# EAGLE design openevsetester (EAGLE 9.6.2)

## Sheet 1 of 7
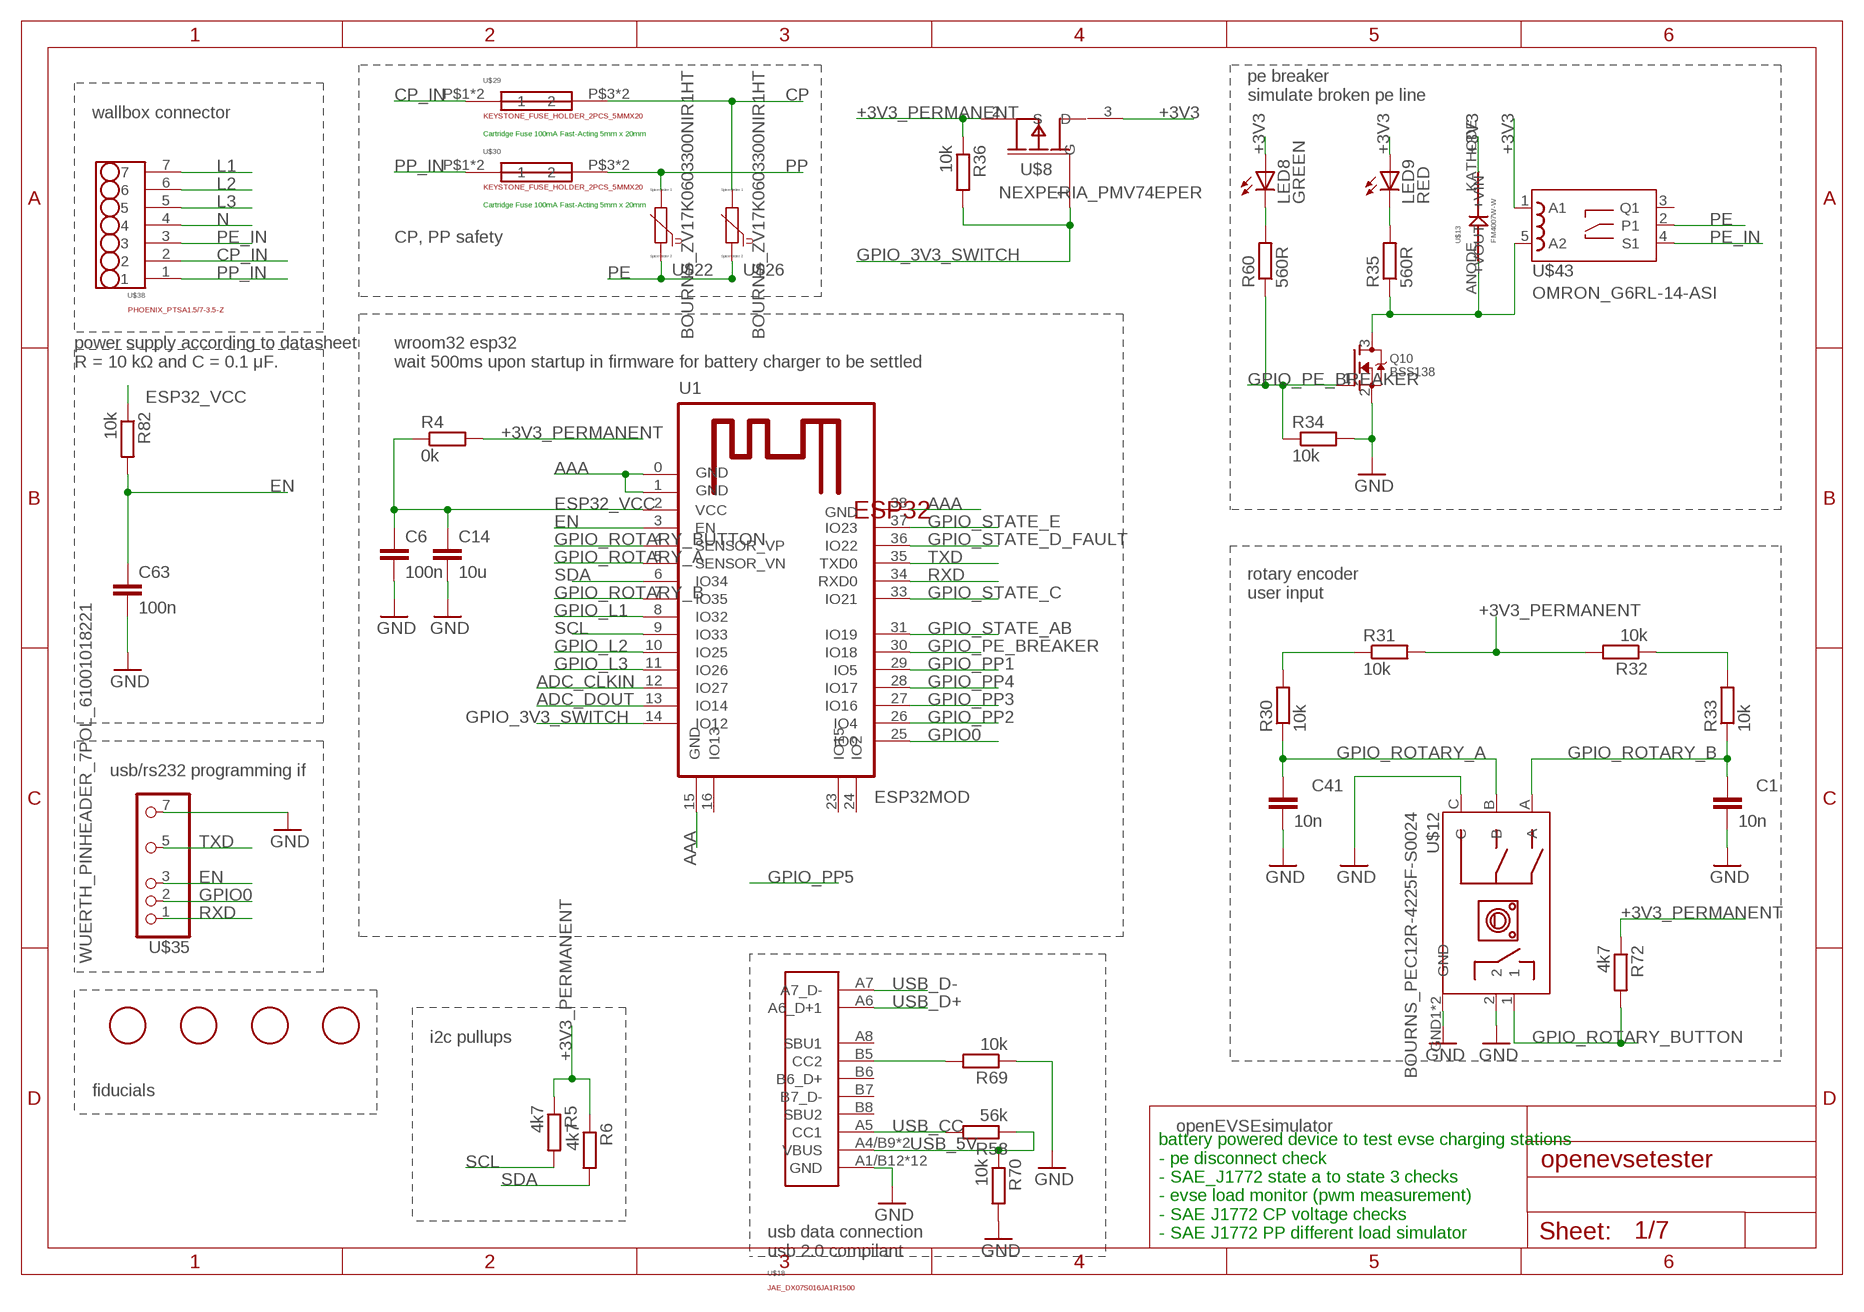
[diagram p0: schematic, sheet 1]

### Parts
C1  10n  C-EUC0402  [C0402]
C6  100n  C-EUC0402  [C0402]
C14  10u  C-EUC0805  [C0805]
C41  10n  C-EUC0402  [C0402]
C63  100n  C-EUC0402  [C0402]
LED8  GREEN  LEDSML0603  [SML0603]
LED9  RED  LEDSML0603  [SML0603]
Q10  BSS138  MOSFET-NREFLOW  [SOT23]
R4  0k  R-EU_R0402  [R0402]
R5  4k7  R-EU_R0402  [R0402]
R6  4k7  R-EU_R0402  [R0402]
R30  10k  R-EU_R0402  [R0402]
R31  10k  R-EU_R0402  [R0402]
R32  10k  R-EU_R0402  [R0402]
R33  10k  R-EU_R0402  [R0402]
R34  10k  R-EU_R0402  [R0402]
R35  560R  R-EU_R0402  [R0402]
R36  10k  R-EU_R0402  [R0402]
R58  56k  R-EU_R0402  [R0402]
R60  560R  R-EU_R0402  [R0402]
R69  10k  R-EU_R0402  [R0402]
R70  10k  R-EU_R0402  [R0402]
R72  4k7  R-EU_R0402  [R0402]
R82  10k  R-EU_R0402  [R0402]
U1  ESP32MOD  [ESP32MOD]
U$8  NEXPERIA_PMV74EPER  [SOT23]
U$12  BOURNS_PEC12R-4225F-S0024  [BOURNS_PEC12RXXX]
U$13  FM4007W-W  [SMX]
U$18  JAE_DX07S016JA1R1500  [JAE_DX07S016JA1R1500]
U$19  FIDUCIAL  [FIDUCIAL_1MM]
U$21  FIDUCIAL  [FIDUCIAL_1MM]
U$22  BOURNS_ZV17K0603300NIR1HT  [0603]
U$23  FIDUCIAL  [FIDUCIAL_1MM]
U$24  FIDUCIAL  [FIDUCIAL_1MM]
U$26  BOURNS_ZV17K0603300NIR1HT  [0603]
U$29  KEYSTONE_FUSE_HOLDER_2PCS_5MMX20  [KEYSTONE_PC_5MM_FUSE_CLIP]
U$30  KEYSTONE_FUSE_HOLDER_2PCS_5MMX20  [KEYSTONE_PC_5MM_FUSE_CLIP]
U$35  WUERTH_PINHEADER_7POL_61001018221  [PINHEADER_SMD_7POL_ESP32_PRG]
U$38  PHOENIX_PTSA1.5/7-3.5-Z  [PHOENIX_PTSA_7POL_3.5MM]
U$43  OMRON_G6RL-14-ASI  [OMRON_G6RL-14-ASI]

### Nets
+3V3: LED8.A LED9.A U$8.3(D) U$13.KATHODE(+VOUT) U$43.1(A1) ; also sheet 5,7
+3V3_PERMANENT: R4.2 R5.1 R6.1 R31.2 R32.2 R36.1 R72.1 U$8.2(S) ; also sheet 4,7
AAA: C1.2 C6.2 C14.2 C41.2 C63.2 Q10.2(S) R34.2 R69.1 R70.2 U1.0(GND) U1.1(GND) U1.15(GND) U1.38(GND) U$12.2 U$12.C U$12.GND1(GND) U$12.GND2(GND) U$18.A1/B12(GND) U$18.A12/B1(GND) U$18.G1(GND) U$18.G2(GND) U$18.G3(GND) U$18.G4(GND) U$18.G5(GND) U$18.G6(GND) U$18.G7(GND) U$18.G8(GND) U$18.P1(GND) U$18.P2(GND) U$35.7 ; supply symbol labelled GND ; also sheet 2,3,4,5,6,7
ADC_CLKIN: U1.12(IO27) ; also sheet 5
ADC_DOUT: U1.13(IO14) ; also sheet 5
CP: U$26.1 U$29.P$3 U$29.PAD2 ; also sheet 3,5
CP_IN: U$29.P$1 U$29.PAD1 U$38.2
EN: C63.1 R82.2 U1.3(EN) U$35.3
ESP32_VCC: C6.1 C14.1 R4.1 R82.1 U1.2(VCC)
GPIO0: U1.25(IO0) U$35.2
GPIO_3V3_SWITCH: R36.2 U1.14(IO12) U$8.1(G)
GPIO_L1: U1.8(IO32) ; also sheet 6
GPIO_L2: U1.10(IO25) ; also sheet 6
GPIO_L3: U1.11(IO26) ; also sheet 6
GPIO_PE_BREAKER: Q10.1(G) R34.1 R60.1 U1.30(IO18)
GPIO_PP1: U1.29(IO5) ; also sheet 2
GPIO_PP2: U1.26(IO4) ; also sheet 2
GPIO_PP3: U1.27(IO16) ; also sheet 2
GPIO_PP4: U1.28(IO17) ; also sheet 2
GPIO_ROTARY_A: C41.1 R30.1 U1.5(SENSOR_VN) U$12.B
GPIO_ROTARY_B: C1.1 R33.1 U1.7(IO35) U$12.A
GPIO_ROTARY_BUTTON: R72.2 U1.4(SENSOR_VP) U$12.1
GPIO_STATE_AB: U1.31(IO19) ; also sheet 3
GPIO_STATE_C: U1.33(IO21) ; also sheet 3
GPIO_STATE_D_FAULT: U1.36(IO22) ; also sheet 3
GPIO_STATE_E: U1.37(IO23) ; also sheet 3
L1: U$38.7 ; also sheet 6
L2: U$38.6 ; also sheet 6
L3: U$38.5 ; also sheet 6
N: U$38.4 ; also sheet 6
N$1: LED9.C R35.2
N$14: Q10.3(D) R35.1 U$13.ANODE(+VIN) U$43.5(A2)
N$23: LED8.C R60.2
N$39: R69.2 U$18.B5(CC2)
N$40: R30.2 R31.1
N$41: R32.1 R33.2
PE: U$22.2 U$26.2 U$43.2(P1) ; also sheet 2,3,5
PE_IN: U$38.3 U$43.4(S1)
PP: U$22.1 U$30.P$3 U$30.PAD2 ; also sheet 2
PP_IN: U$30.P$1 U$30.PAD1 U$38.1
RXD: U1.34(RXD0) U$35.1
SCL: R5.2 U1.9(IO33) ; also sheet 4,7
SDA: R6.2 U1.6(IO34) ; also sheet 4,7
TXD: U1.35(TXD0) U$35.5
USB_5V: R58.1 R70.1 U$18.A4/B9(VBUS) U$18.B4/A9(VBUS)
USB_CC: R58.2 U$18.A5(CC1)
USB_D+: U$18.A6(A6_D+1)
USB_D-: U$18.A7(A7_D-)
Unconnected: U1.16(IO13) U1.23(IO15) U1.24(IO2) U$18.A8(SBU1) U$18.B6(B6_D+) U$18.B7(B7_D-) U$18.B8(SBU2) U$43.3(Q1)

### Notes on the sheet
- pe breaker
  simulate broken pe line
- wallbox connector
- Cartridge Fuse 100mA Fast-Acting 5mm x 20mm
- Cartridge Fuse 100mA Fast-Acting 5mm x 20mm
- CP, PP safety
- power supply according to datasheet 
  R = 10 kΩ and C = 0.1 μF.
- wroom32 esp32
  wait 500ms upon startup in firmware for battery charger to be settled
- rotary encoder
  user input
- usb/rs232 programming if
- i2c pullups
- fiducials
- openEVSEsimulator
- battery powered device to test evse charging stations
  - pe disconnect check
  - SAE_J1772 state a to state 3 checks
  - evse load monitor (pwm measurement)
  - SAE J1772 CP voltage checks
  - SAE J1772 PP different load simulator
- usb data connection
  usb 2.0 compilant

## Sheet 2 of 7
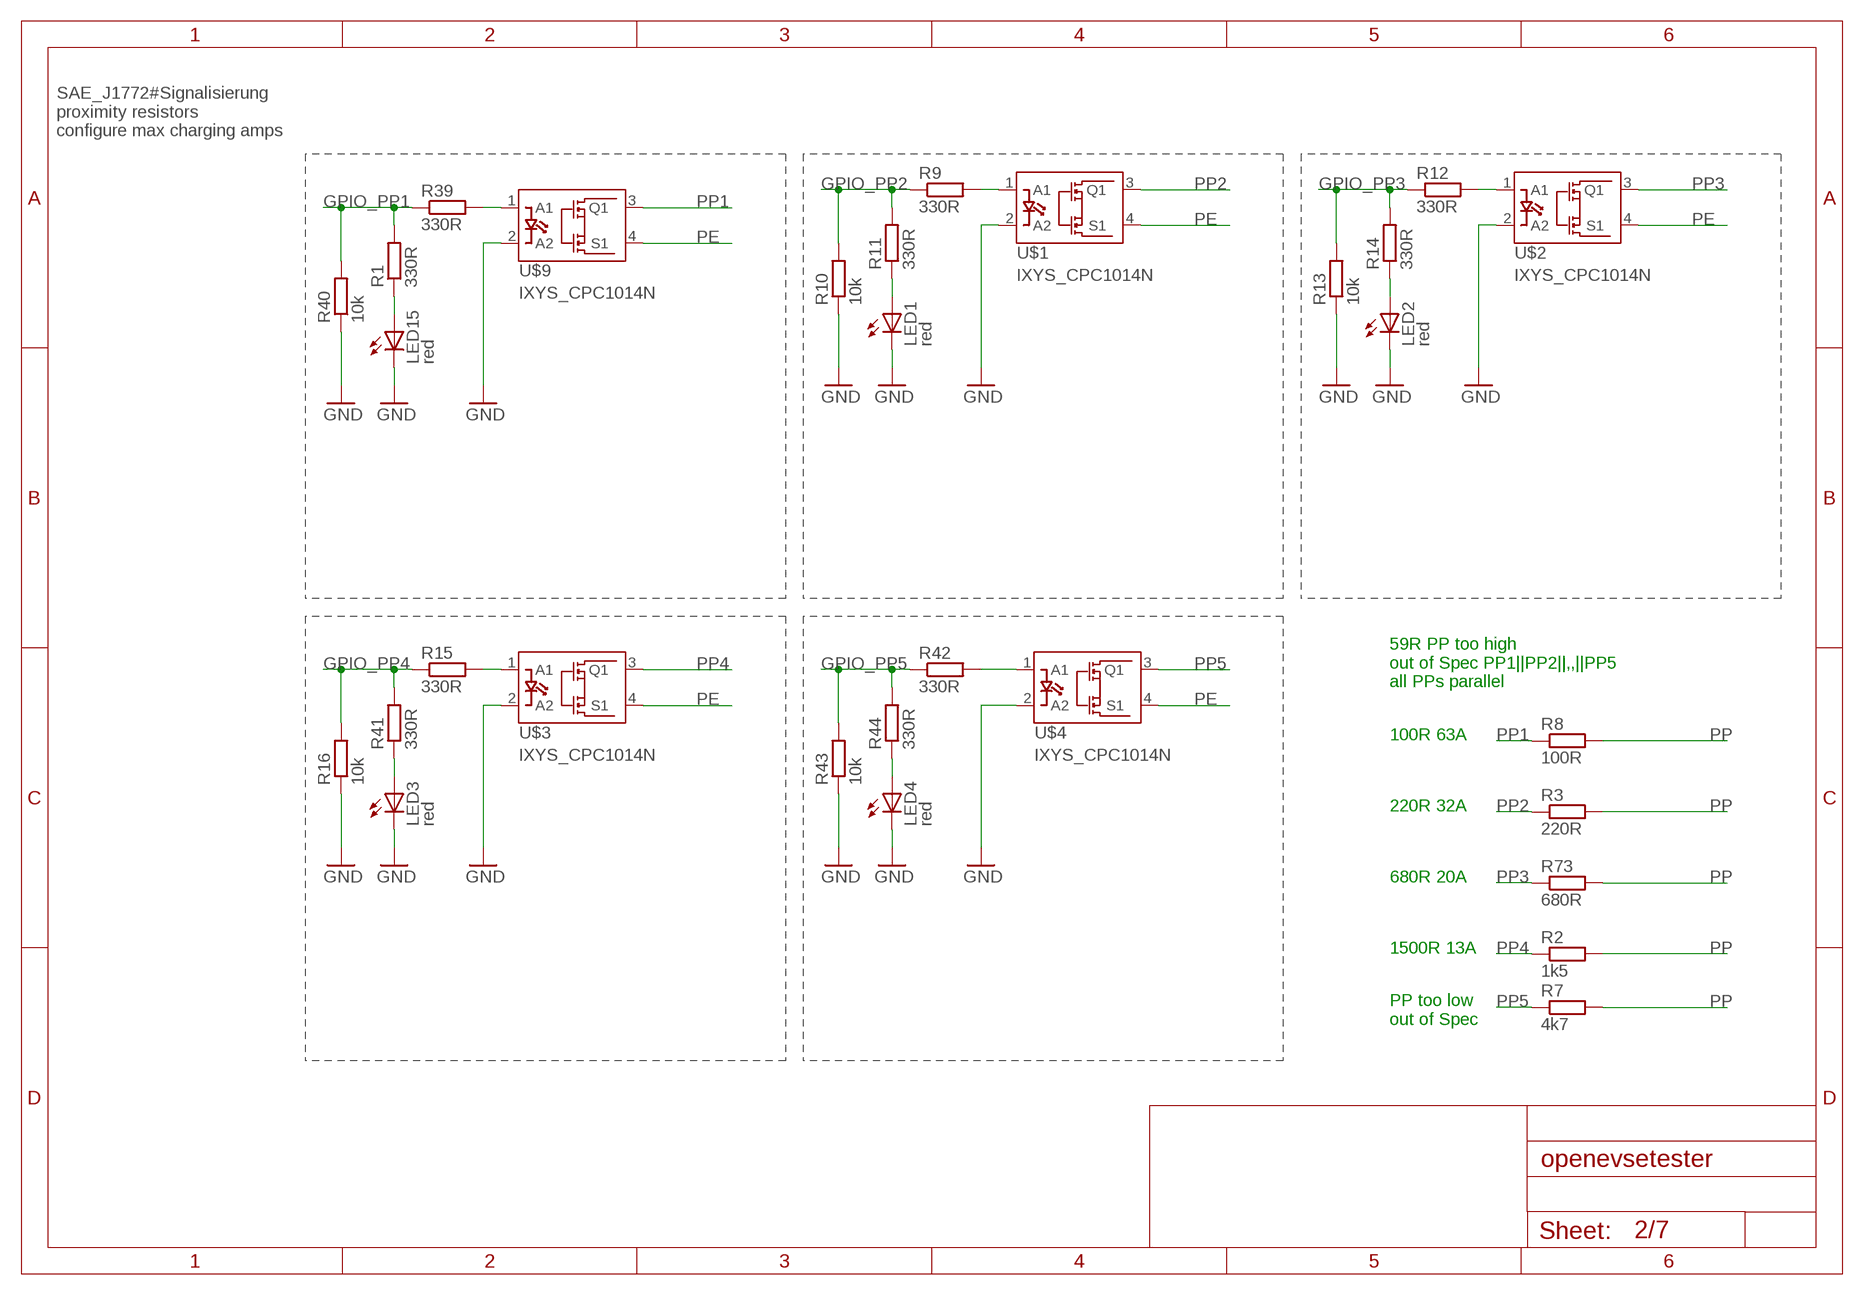
[diagram p1: schematic, sheet 2]

### Parts
LED1  red  LEDSML0603  [SML0603]
LED2  red  LEDSML0603  [SML0603]
LED3  red  LEDSML0603  [SML0603]
LED4  red  LEDSML0603  [SML0603]
LED15  red  LEDSML0603  [SML0603]
R1  330R  R-EU_R0402  [R0402]
R2  1k5  R-EU_R1210  [R1210]
R3  220R  R-EU_R1210  [R1210]
R7  4k7  R-EU_R1210  [R1210]
R8  100R  R-EU_R1210  [R1210]
R9  330R  R-EU_R0402  [R0402]
R10  10k  R-EU_R0402  [R0402]
R11  330R  R-EU_R0402  [R0402]
R12  330R  R-EU_R0402  [R0402]
R13  10k  R-EU_R0402  [R0402]
R14  330R  R-EU_R0402  [R0402]
R15  330R  R-EU_R0402  [R0402]
R16  10k  R-EU_R0402  [R0402]
R39  330R  R-EU_R0402  [R0402]
R40  10k  R-EU_R0402  [R0402]
R41  330R  R-EU_R0402  [R0402]
R42  330R  R-EU_R0402  [R0402]
R43  10k  R-EU_R0402  [R0402]
R44  330R  R-EU_R0402  [R0402]
R73  680R  R-EU_R1210  [R1210]
U$1  IXYS_CPC1014N  [SOIC-4]
U$2  IXYS_CPC1014N  [SOIC-4]
U$3  IXYS_CPC1014N  [SOIC-4]
U$4  IXYS_CPC1014N  [SOIC-4]
U$9  IXYS_CPC1014N  [SOIC-4]

### Nets
AAA: LED1.C LED2.C LED3.C LED4.C LED15.C R10.1 R13.1 R16.1 R40.1 R43.1 U$1.2(A2) U$2.2(A2) U$3.2(A2) U$4.2(A2) U$9.2(A2) ; supply symbol labelled GND ; also sheet 1,3,4,5,6,7
GPIO_PP1: R1.2 R39.1 R40.2 ; also sheet 1
GPIO_PP2: R9.1 R10.2 R11.2 ; also sheet 1
GPIO_PP3: R12.1 R13.2 R14.2 ; also sheet 1
GPIO_PP4: R15.1 R16.2 R41.2 ; also sheet 1
GPIO_PP5: R42.1 R43.2 R44.2 ; also sheet 1
N$4: R9.2 U$1.1(A1)
N$5: LED1.A R11.1
N$7: R12.2 U$2.1(A1)
N$10: LED2.A R14.1
N$11: R15.2 U$3.1(A1)
N$12: LED3.A R41.1
N$13: R42.2 U$4.1(A1)
N$16: R39.2 U$9.1(A1)
N$17: LED15.A R1.1
N$18: LED4.A R44.1
PE: U$1.4(S1) U$2.4(S1) U$3.4(S1) U$4.4(S1) U$9.4(S1) ; also sheet 1,3,5
PP: R2.2 R3.2 R7.2 R8.2 R73.2 ; also sheet 1
PP1: R8.1 U$9.3(Q1)
PP2: R3.1 U$1.3(Q1)
PP3: R73.1 U$2.3(Q1)
PP4: R2.1 U$3.3(Q1)
PP5: R7.1 U$4.3(Q1)

### Notes on the sheet
- SAE_J1772#Signalisierung
  proximity resistors
  configure max charging amps
- 59R PP too high
  out of Spec PP1||PP2||,,||PP5
  all PPs parallel
- 100R 63A
- 220R 32A
- 680R 20A
- 1500R 13A
- PP too low
  out of Spec

## Sheet 3 of 7
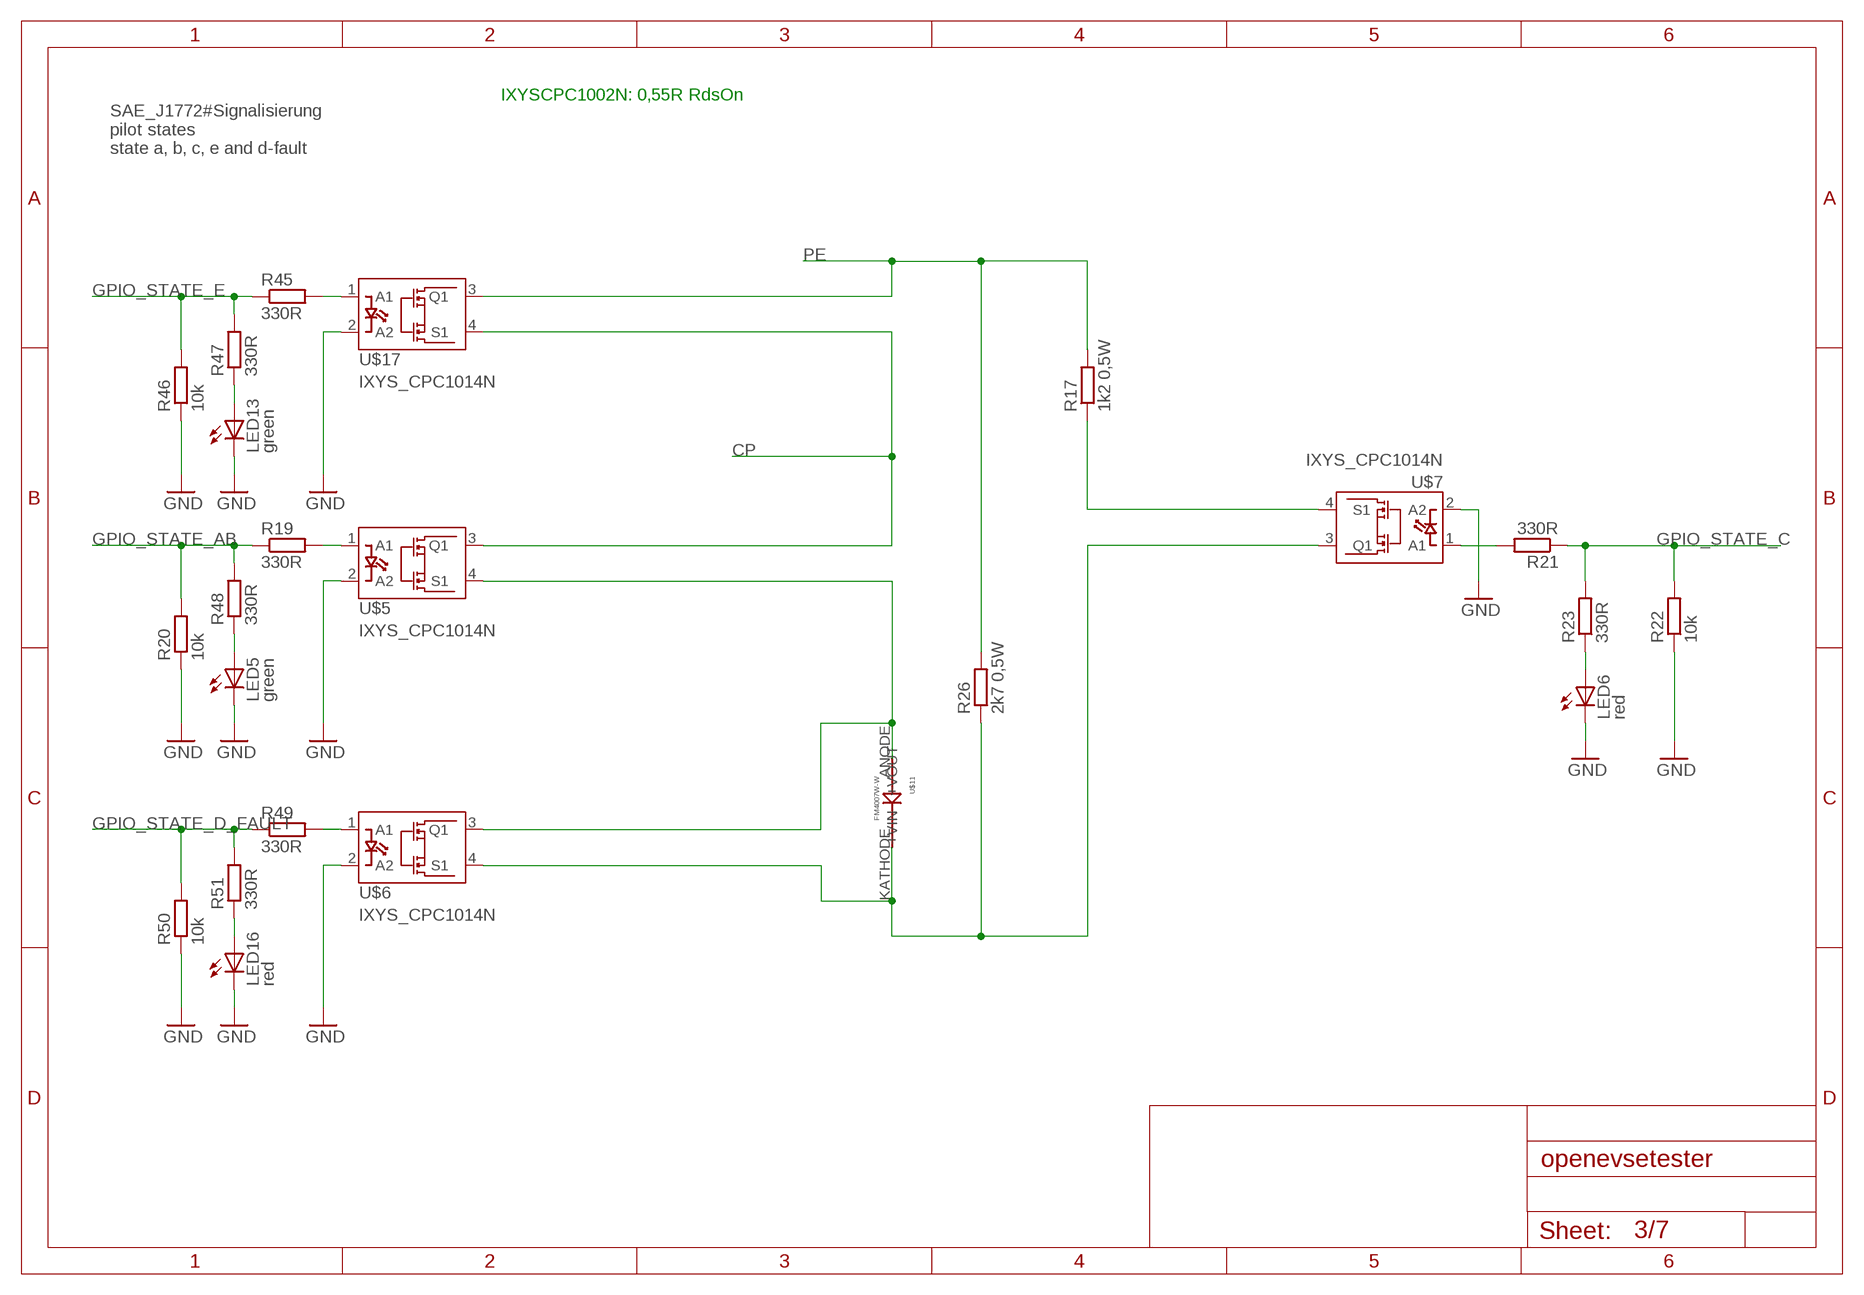
[diagram p2: schematic, sheet 3]

### Parts
LED5  green  LEDSML0603  [SML0603]
LED6  red  LEDSML0603  [SML0603]
LED13  green  LEDSML0603  [SML0603]
LED16  red  LEDSML0603  [SML0603]
R17  1k2 0,5W  R-EU_R0805  [R0805]
R19  330R  R-EU_R0402  [R0402]
R20  10k  R-EU_R0402  [R0402]
R21  330R  R-EU_R0402  [R0402]
R22  10k  R-EU_R0402  [R0402]
R23  330R  R-EU_R0402  [R0402]
R26  2k7 0,5W  R-EU_R0805  [R0805]
R45  330R  R-EU_R0402  [R0402]
R46  10k  R-EU_R0402  [R0402]
R47  330R  R-EU_R0402  [R0402]
R48  330R  R-EU_R0402  [R0402]
R49  330R  R-EU_R0402  [R0402]
R50  10k  R-EU_R0402  [R0402]
R51  330R  R-EU_R0402  [R0402]
U$5  IXYS_CPC1014N  [SOIC-4]
U$6  IXYS_CPC1014N  [SOIC-4]
U$7  IXYS_CPC1014N  [SOIC-4]
U$11  FM4007W-W  [SMX]
U$17  IXYS_CPC1014N  [SOIC-4]

### Nets
AAA: LED5.C LED6.C LED13.C LED16.C R20.1 R22.1 R46.1 R50.1 U$5.2(A2) U$6.2(A2) U$7.2(A2) U$17.2(A2) ; supply symbol labelled GND ; also sheet 1,2,4,5,6,7
CP: U$5.3(Q1) U$17.4(S1) ; also sheet 1,5
GPIO_STATE_AB: R19.1 R20.2 R48.2 ; also sheet 1
GPIO_STATE_C: R21.1 R22.2 R23.2 ; also sheet 1
GPIO_STATE_D_FAULT: R49.1 R50.2 R51.2 ; also sheet 1
GPIO_STATE_E: R45.1 R46.2 R47.2 ; also sheet 1
N$19: R45.2 U$17.1(A1)
N$20: R19.2 U$5.1(A1)
N$21: R21.2 U$7.1(A1)
N$22: LED6.A R23.1
N$25: LED5.A R48.1
N$26: U$5.4(S1) U$6.3(Q1) U$11.ANODE(+VIN)
N$30: LED13.A R47.1
N$31: R49.2 U$6.1(A1)
N$32: LED16.A R51.1
PE: R17.2 R26.2 U$17.3(Q1) ; also sheet 1,2,5
PP6: R17.1 U$7.4(S1)
PP7: R26.1 U$6.4(S1) U$7.3(Q1) U$11.KATHODE(+VOUT)

### Notes on the sheet
- IXYSCPC1002N: 0,55R RdsOn
- SAE_J1772#Signalisierung
  pilot states
  state a, b, c, e and d-fault

## Sheet 4 of 7
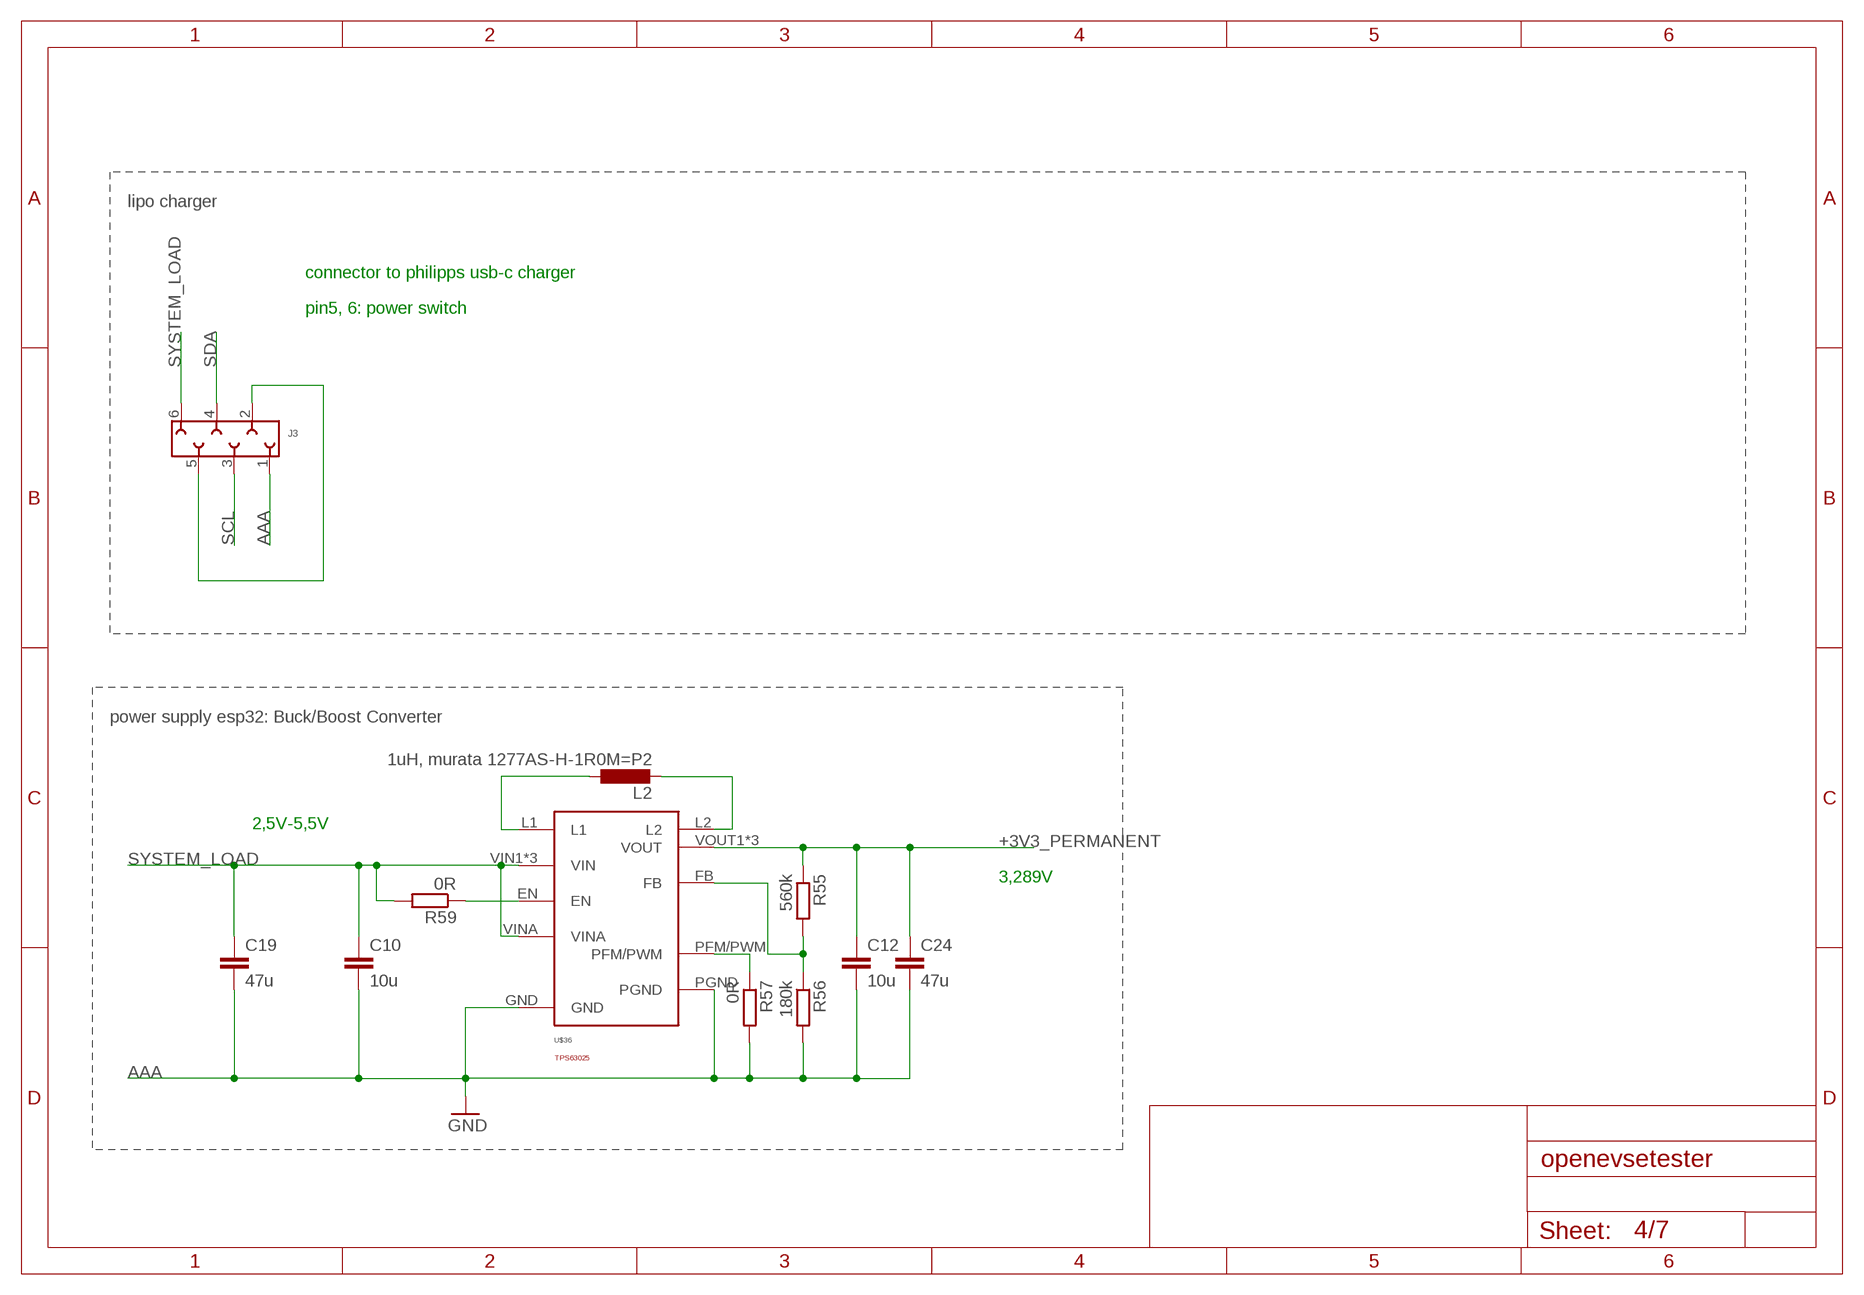
[diagram p3: schematic, sheet 4]

### Parts
C10  10u  C-EUC0805  [C0805]
C12  10u  C-EUC0805  [C0805]
C19  47u  C-EUC1206  [C1206]
C24  47u  C-EUC0805  [C0805]
J3  6100XX11921_61000611921  [61000611921]
L2  1uH, murata 1277AS-H-1R0M=P2  L-EUL3225M  [L3225M]
R55  560k  R-EU_R0402  [R0402]
R56  180k  R-EU_R0402  [R0402]
R57  0R  R-EU_R0402  [R0402]
R59  0R  R-EU_R0402  [R0402]
U$36  TPS63025  [VQFN14]

### Nets
+3V3_PERMANENT: C12.1 C24.1 R55.1 U$36.VOUT1(VOUT) U$36.VOUT2(VOUT) U$36.VOUT3(VOUT) ; also sheet 1,7
AAA: C10.2 C12.2 C19.2 C24.2 J3.1 R56.2 R57.2 U$36.GND U$36.PGND ; supply symbol labelled GND ; also sheet 1,2,3,5,6,7
L13V3: L2.1 U$36.L1
L23V3: L2.2 U$36.L2
N$33: J3.2 J3.5
N$36: R59.1 U$36.EN
N$38: R55.2 R56.1 U$36.FB
N$43: R57.1 U$36.PFM/PWM
SCL: J3.3 ; also sheet 1,7
SDA: J3.4 ; also sheet 1,7
SYSTEM_LOAD: C10.1 C19.1 J3.6 R59.2 U$36.VIN1(VIN) U$36.VIN2(VIN) U$36.VIN3(VIN) U$36.VINA

### Notes on the sheet
- lipo charger
- connector to philipps usb-c charger
- pin5, 6: power switch
- power supply esp32: Buck/Boost Converter
- 2,5V-5,5V
- 3,289V

## Sheet 5 of 7
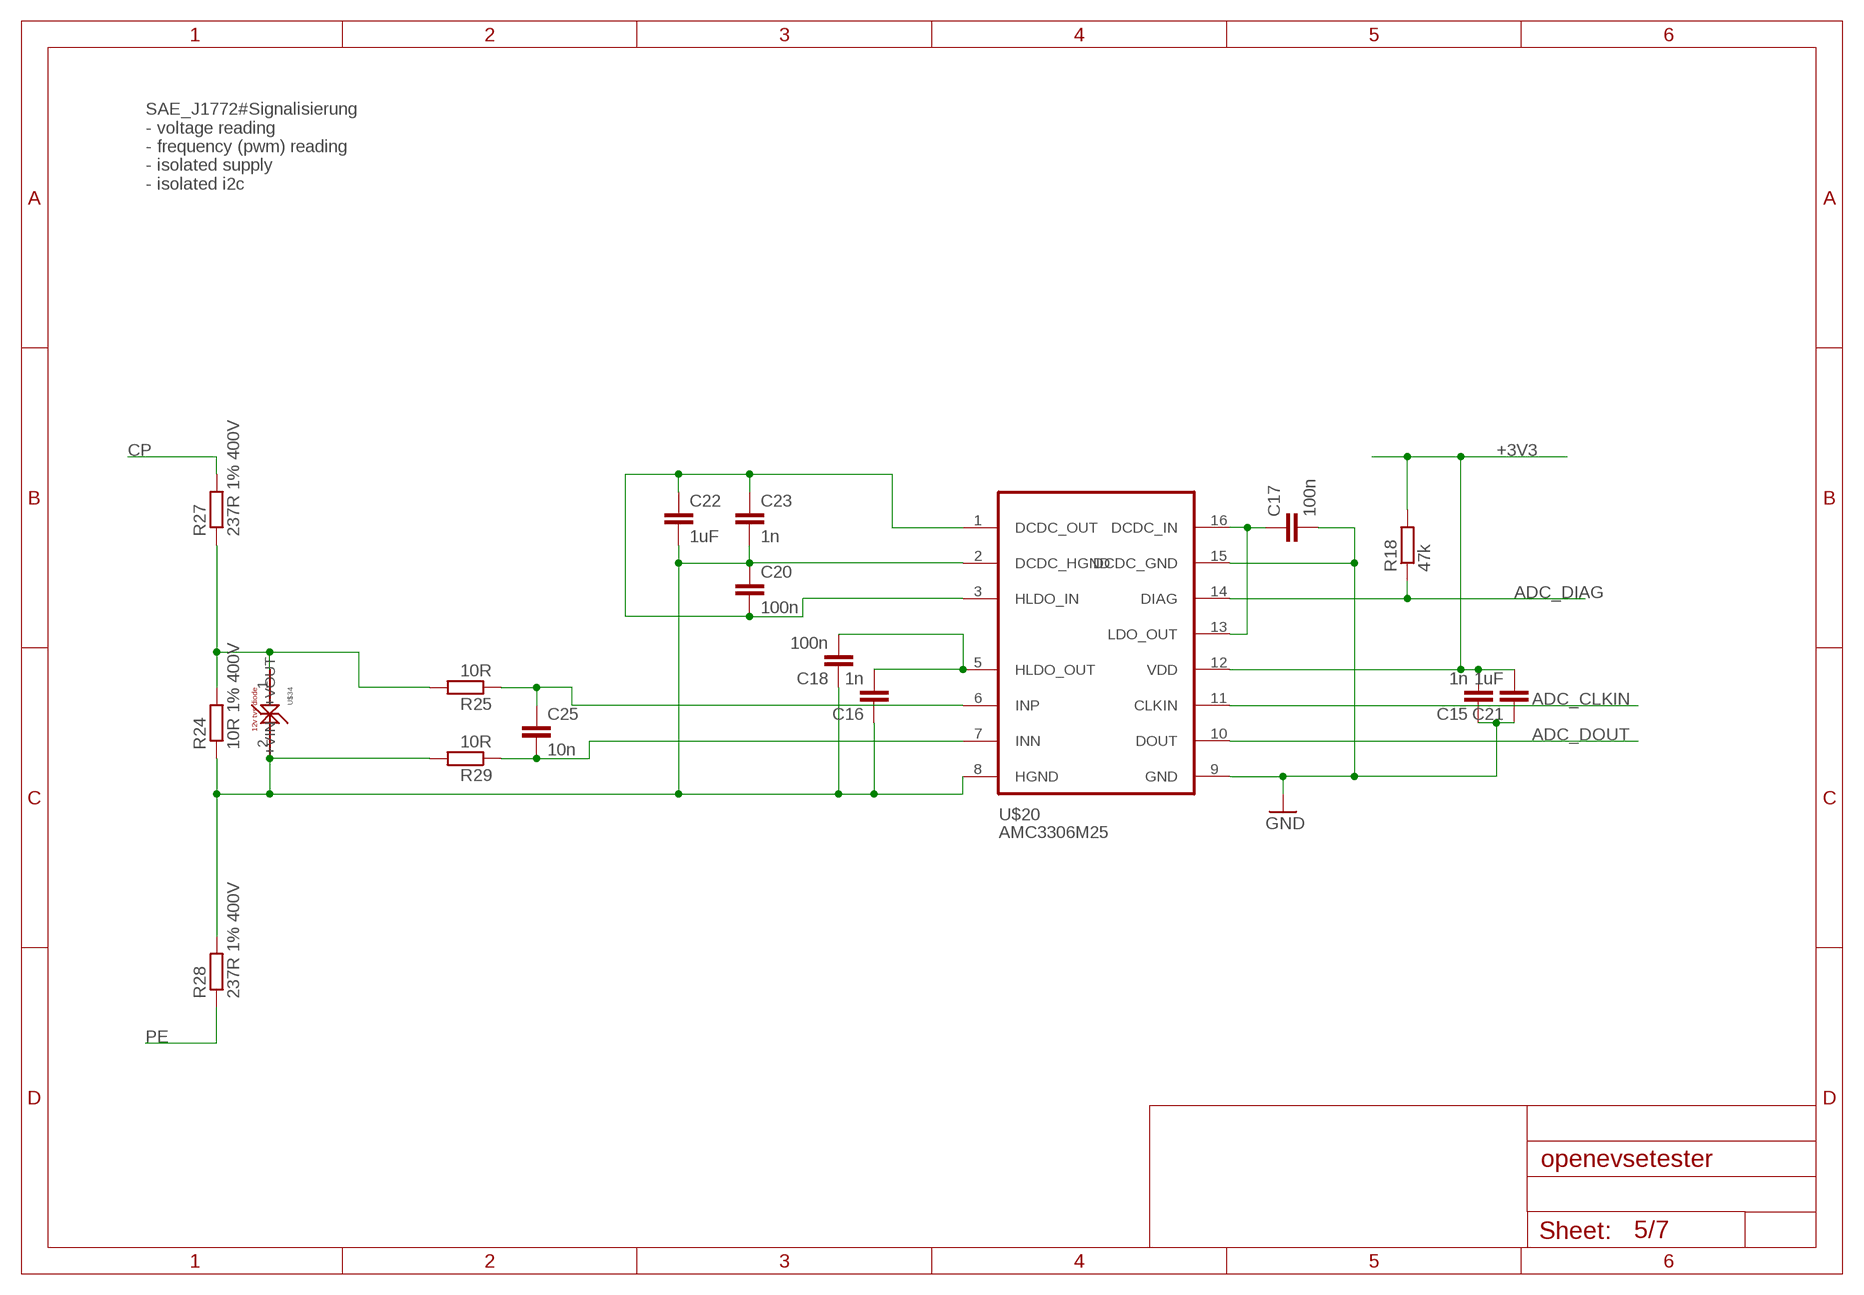
[diagram p4: schematic, sheet 5]

### Parts
C15  1n  C-EUC1206  [C1206]
C16  1n  C-EUC1206  [C1206]
C17  100n  C-EUC0603  [C0603]
C18  100n  C-EUC1206  [C1206]
C20  100n  C-EUC0603  [C0603]
C21  1uF  C-EUC1206  [C1206]
C22  1uF  C-EUC0603  [C0603]
C23  1n  C-EUC0603  [C0603]
C25  10n  C-EUC0603  [C0603]
R18  47k  R-EU_R0402  [R0402]
R24  10R 1% 400V  R-EU_R2512  [R2512]
R25  10R  R-EU_R2512  [R2512]
R27  237R 1% 400V  R-EU_R2010  [R2010]
R28  237R 1% 400V  R-EU_R2010  [R2010]
R29  10R  R-EU_R2512  [R2512]
U$20  AMC3306M25  [SOIC-16]
U$34  12v tvs diode  LXESXXA  [0402]

### Nets
+3V3: C15.2 C21.2 R18.2 U$20.12(VDD) ; also sheet 1,7
AAA: C15.1 C17.2 C21.1 U$20.9(GND) U$20.15(DCDC_GND) ; supply symbol labelled GND ; also sheet 1,2,3,4,6,7
ADC_CLKIN: U$20.11(CLKIN) ; also sheet 1
ADC_DIAG: R18.1 U$20.14(DIAG)
ADC_DOUT: U$20.10(DOUT) ; also sheet 1
CP: R27.2 ; also sheet 1,3
N$37: C17.1 U$20.13(LDO_OUT) U$20.16(DCDC_IN)
N$42: C25.1 R25.1 U$20.6(INP)
N$48: R24.2 R25.2 R27.1 U$34.1(+VIN)
N$49: C25.2 R29.1 U$20.7(INN)
N$50: C16.1 C18.1 C20.1 C22.2 C23.2 R24.1 R28.2 R29.2 U$20.2(DCDC_HGND) U$20.8(HGND) U$34.2(+VOUT)
N$52: C16.2 C18.2 U$20.5(HLDO_OUT)
N$54: C20.2 C22.1 C23.1 U$20.1(DCDC_OUT) U$20.3(HLDO_IN)
PE: R28.1 ; also sheet 1,2,3

### Notes on the sheet
- SAE_J1772#Signalisierung
  - voltage reading
  - frequency (pwm) reading
  - isolated supply
  - isolated i2c

## Sheet 6 of 7
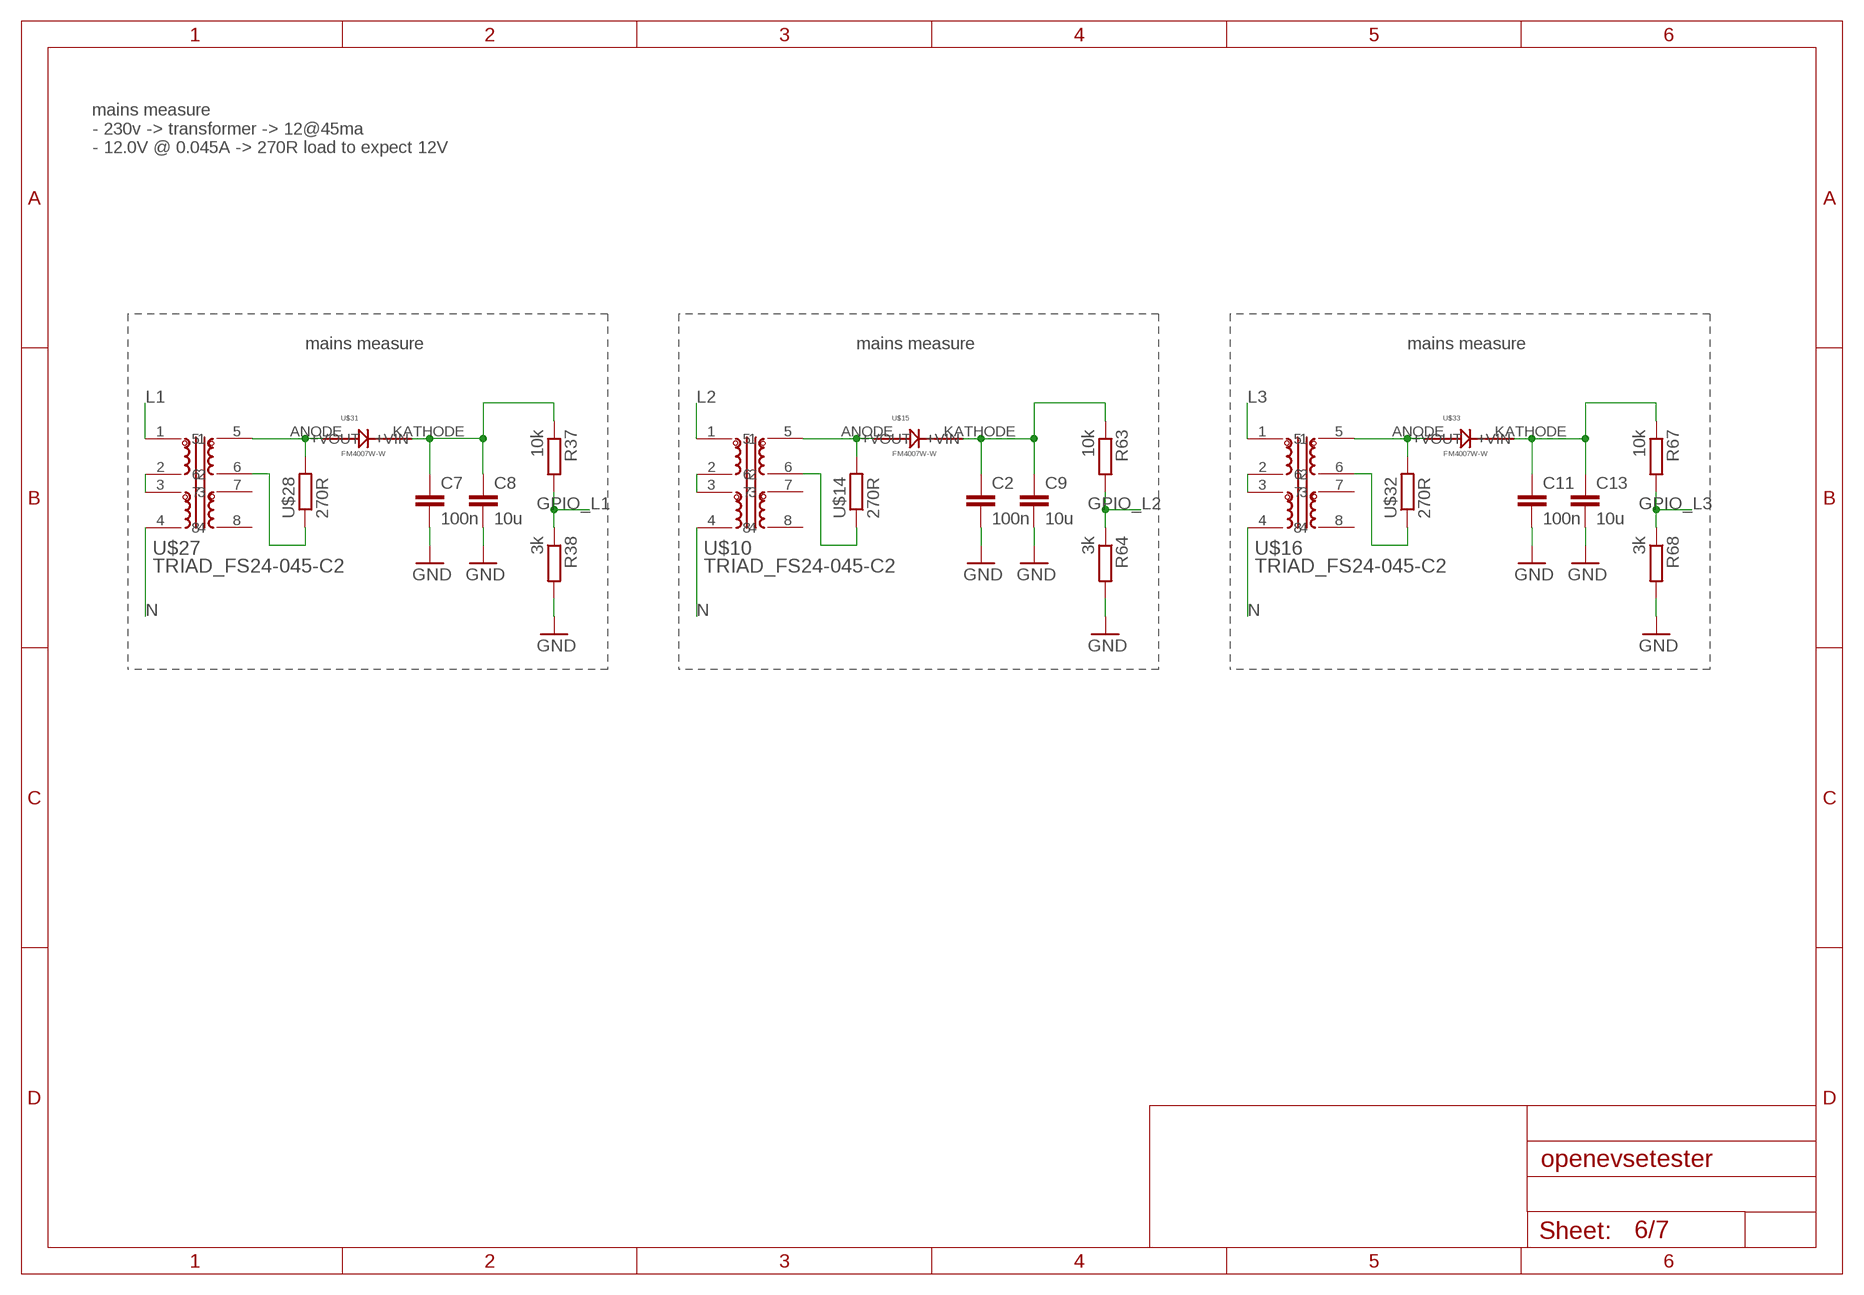
[diagram p5: schematic, sheet 6]

### Parts
C2  100n  C-EUC0402  [C0402]
C7  100n  C-EUC0402  [C0402]
C8  10u  C-EUC0805  [C0805]
C9  10u  C-EUC0805  [C0805]
C11  100n  C-EUC0402  [C0402]
C13  10u  C-EUC0805  [C0805]
R37  10k  R-EU_R0402  [R0402]
R38  3k  R-EU_R0402  [R0402]
R63  10k  R-EU_R0402  [R0402]
R64  3k  R-EU_R0402  [R0402]
R67  10k  R-EU_R0402  [R0402]
R68  3k  R-EU_R0402  [R0402]
U$10  TRIAD_FS24-045-C2  [TRIAD_FS24-045-C2]
U$14  270R  R2512  [2512]
U$15  FM4007W-W  [SMX]
U$16  TRIAD_FS24-045-C2  [TRIAD_FS24-045-C2]
U$27  TRIAD_FS24-045-C2  [TRIAD_FS24-045-C2]
U$28  270R  R2512  [2512]
U$31  FM4007W-W  [SMX]
U$32  270R  R2512  [2512]
U$33  FM4007W-W  [SMX]

### Nets
+3V2: C2.1 C9.1 R63.1 U$15.KATHODE(+VOUT)
+3V4: C11.1 C13.1 R67.1 U$33.KATHODE(+VOUT)
AAA: C2.2 C7.2 C8.2 C9.2 C11.2 C13.2 R38.2 R64.2 R68.2 ; supply symbol labelled GND ; also sheet 1,2,3,4,5,7
GPIO_L1: R37.2 R38.1 ; also sheet 1
GPIO_L2: R63.2 R64.1 ; also sheet 1
GPIO_L3: R67.2 R68.1 ; also sheet 1
L1: U$27.1 ; also sheet 1
L2: U$10.1 ; also sheet 1
L3: U$16.1 ; also sheet 1
N: U$10.4 U$16.4 U$27.4 ; also sheet 1
N$2: U$10.2 U$10.3
N$3: U$10.5 U$14.2 U$15.ANODE(+VIN)
N$6: U$10.6 U$14.1
N$8: U$16.2 U$16.3
N$9: U$16.5 U$32.2 U$33.ANODE(+VIN)
N$15: U$16.6 U$32.1
N$34: C7.1 C8.1 R37.1 U$31.KATHODE(+VOUT)
N$44: U$27.2 U$27.3
N$46: U$27.5 U$28.2 U$31.ANODE(+VIN)
N$47: U$27.6 U$28.1
Unconnected: U$10.7 U$10.8 U$16.7 U$16.8 U$27.7 U$27.8

### Notes on the sheet
- mains measure
  - 230v -> transformer -> 12@45ma
  - 12.0V @ 0.045A -> 270R load to expect 12V
- mains measure | mains measure | mains measure

## Sheet 7 of 7
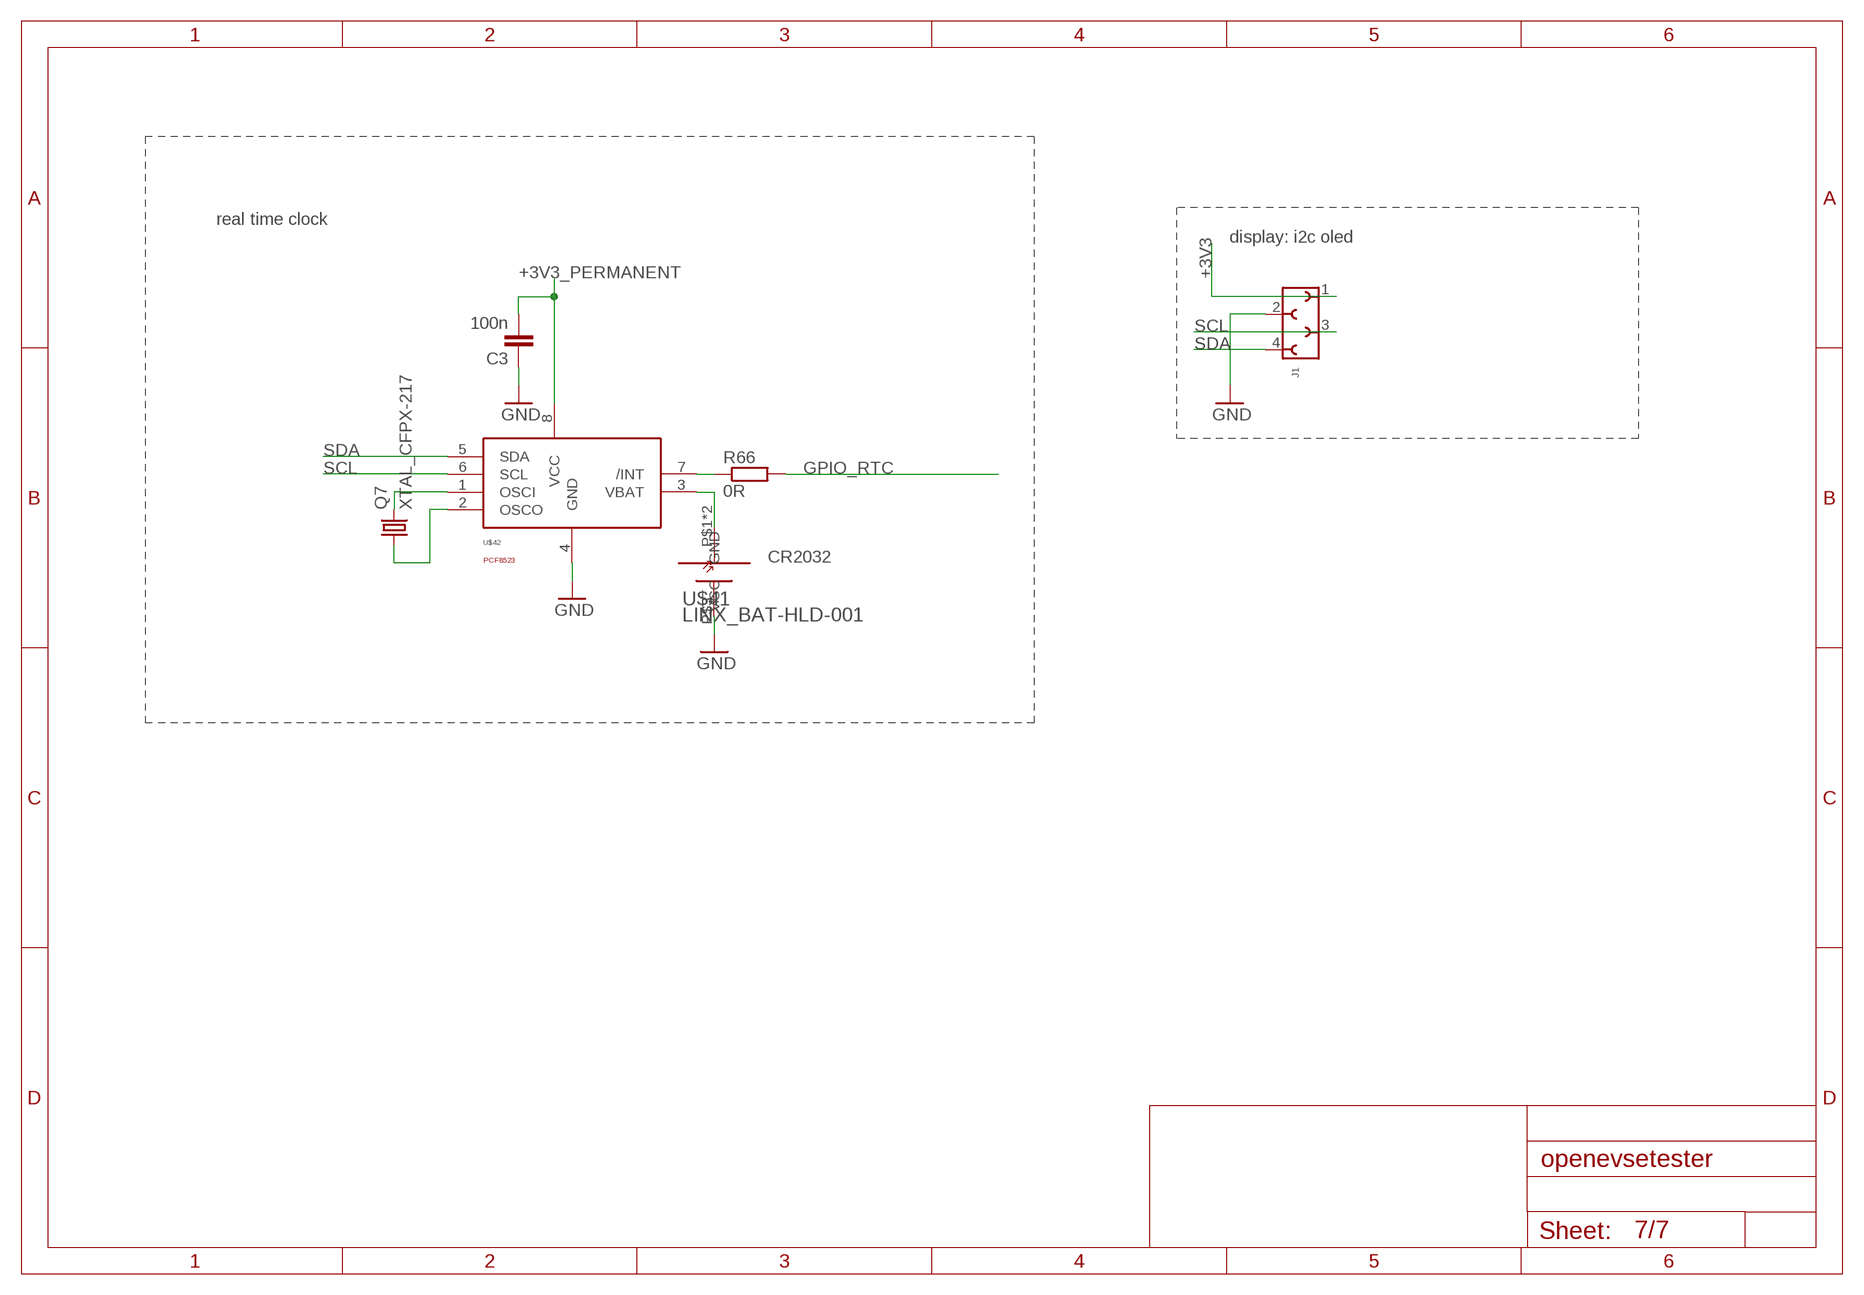
[diagram p6: schematic, sheet 7]

### Parts
C3  100n  C-EUC0402  [C0402]
J1  6100XX11921_61000411921  [61000411921]
Q7  XTAL_CFPX-217  [FC-12M]
R66  0R  R-EU_R0402  [R0402]
U$41  LINX_BAT-HLD-001  [BATTERY_HOLDER_CR2032]
U$42  PCF8523  [SOIC-8]

### Nets
+3V3: J1.1 ; also sheet 1,5
+3V3_PERMANENT: C3.2 U$42.8(VCC) ; also sheet 1,4
AAA: C3.1 J1.2 U$41.P$3(GND) U$42.4(GND) ; supply symbol labelled GND ; also sheet 1,2,3,4,5,6
GPIO_RTC: R66.2
N$99: Q7.2 U$42.1(OSCI)
N$100: Q7.1 U$42.2(OSCO)
N$101: R66.1 U$42.7(/INT)
SCL: J1.3 U$42.6(SCL) ; also sheet 1,4
SDA: J1.4 U$42.5(SDA) ; also sheet 1,4
VBAT: U$41.P$1(VCC) U$41.P$2(VCC) U$42.3(VBAT)

### Notes on the sheet
- real time clock
- display: i2c oled
- CR2032

## Library data of the parts
C1-C3 C6-C14 C19 C24 C41 C63 = rcl:C-EU: CAPACITOR, European symbol
C15-C18 C20-C23 C25 = resistor:C-EU: CAPACITOR, European symbol
J1 = Wurth_Connectors_WR-PHD:6100XX11921_61000411921: WR-PHD 2.54 mm SMT Socket Header ARTICLE PROPERTIES: Pins:4;​ 5;​ 6;​ 8;​ 10;​ 12;​ 14;​ 16;​ 20;​ 24 KIND PROPERTIES: Pitch：2.54 mm Quality Class:3 as per CECC 75 301-802 Rows：Single Gender：Socket Header Type：Straight Type 1;​ Straight Type 2 MATERIAL PROPERTIES: Insulator Material :Nylon 46 Insulator Flammability Rating:UL94 V-0 Contact Material:Copper Alloy Contact Plating:Gold Contact Type:Stamped GENERAL INFORMATION Operating Temperature:-40 up to +125 °C Compliance:Lead free / RoHS ELECTRICAL PROPERTIES: Rated Current:3 A IR 1:3 A Withstanding Voltage:500 V (AC) Contact Resistance:20 mΩ RISO:1000 MΩ CERTIFICATION UL Approval:E323964 PACKAGING PROPERTIES Packaging:Tube <https://katalog.we-online.com/media/images/v2/o64612v209%20Family_WR-PHD_6100xx13321.jpg> Details see: https://katalog.we-online.com/en/em/PHD_2_54_SMT_SOCKET_HEADER_6100XXXXX21 Updated by Yingchun,Shan 2019-10-23 2019 (C) Würth Elektronik; DATASHEET-URL: https://katalog.we-online.com/em/datasheet/61000411921.pdf; GENDER: Socket Header; IR: 3A; MATES: WR-PHD 2.54mm SMT Pin Header/THT Angled Pin Header/THT Pin Header; PACKAGING: Tube; PART-NUMBER: 61000411921; PINS: 4; ROWS: Single; TYPE: Straight Type 1
J3 = Wurth_Connectors_WR-PHD:6100XX11921_61000611921: WR-PHD 2.54 mm SMT Socket Header ARTICLE PROPERTIES: Pins:4;​ 5;​ 6;​ 8;​ 10;​ 12;​ 14;​ 16;​ 20;​ 24 KIND PROPERTIES: Pitch：2.54 mm Quality Class:3 as per CECC 75 301-802 Rows：Single Gender：Socket Header Type：Straight Type 1;​ Straight Type 2 MATERIAL PROPERTIES: Insulator Material :Nylon 46 Insulator Flammability Rating:UL94 V-0 Contact Material:Copper Alloy Contact Plating:Gold Contact Type:Stamped GENERAL INFORMATION Operating Temperature:-40 up to +125 °C Compliance:Lead free / RoHS ELECTRICAL PROPERTIES: Rated Current:3 A IR 1:3 A Withstanding Voltage:500 V (AC) Contact Resistance:20 mΩ RISO:1000 MΩ CERTIFICATION UL Approval:E323964 PACKAGING PROPERTIES Packaging:Tube <https://katalog.we-online.com/media/images/v2/o64612v209%20Family_WR-PHD_6100xx13321.jpg> Details see: https://katalog.we-online.com/en/em/PHD_2_54_SMT_SOCKET_HEADER_6100XXXXX21 Updated by Yingchun,Shan 2019-10-23 2019 (C) Würth Elektronik; DATASHEET-URL: https://katalog.we-online.com/em/datasheet/61000611921.pdf; GENDER: Socket Header; IR: 3A; MATES: WR-PHD 2.54mm SMT Pin Header/THT Angled Pin Header/THT Pin Header; PACKAGING: Tube; PART-NUMBER: 61000611921; PINS: 6; ROWS: Single; TYPE: Straight Type 1
L2 = rcl:L-EU: INDUCTOR, European symbol
LED1-LED6 LED8 LED9 LED13 LED15 LED16 = led:LED: LED OSRAM: - CHIPLED LG R971, LG N971, LY N971, LG Q971, LY Q971, LO R971, LY R971 LH N974, LH R974 LS Q976, LO Q976, LY Q976 LO Q996 - Hyper CHIPLED LW Q18S LB Q993, LB Q99A, LB R99A - SideLED LS A670, LO A670, LY A670, LG A670, LP A670 LB A673, LV A673, LT A673, LW A673 LH A674 LY A675 LS A676, LA A676, LO A676, LY A676, LW A676 LS A679, LY A679, LG A679 - Hyper Micro SIDELED® LS Y876, LA Y876, LO Y876, LY Y876 LT Y87S - SmartLED LW L88C, LW L88S LB L89C, LB L89S, LG L890 LS L89K, LO L89K, LY L89K LS L896, LA L896, LO L896, LY L896 - TOPLED LS T670, LO T670, LY T670, LG T670, LP T670 LSG T670, LSP T670, LSY T670, LOP T670, LYG T670 LG T671, LOG T671, LSG T671 LB T673, LV T673, LT T673, LW T673 LH T674 LS T676, LA T676, LO T676, LY T676, LB T676, LH T676, LSB T676, LW T676 LB T67C, LV T67C, LT T67C, LS T67K, LO T67K, LY T67K, LW E67C LS E67B, LA E67B, LO E67B, LY E67B, LB E67C, LV E67C, LT E67C LW T67C LS T679, LY T679, LG T679 LS T770, LO T770, LY T770, LG T770, LP T770 LB T773, LV T773, LT T773, LW T773 LH T774 LS E675, LA E675, LY E675, LS T675 LS T776, LA T776, LO T776, LY T776, LB T776 LHGB T686 LT T68C, LB T68C - Hyper Mini TOPLED® LB M676 - Mini TOPLED Santana® LG M470 LS M47K, LO M47K, LY M47K Source: http://www.osram.convergy.de LUXEON: - LUMILED® LXK2-PW12-R00, LXK2-PW12-S00, LXK2-PW14-U00, LXK2-PW14-V00 LXK2-PM12-R00, LXK2-PM12-S00, LXK2-PM14-U00 LXK2-PE12-Q00, LXK2-PE12-R00, LXK2-PE12-S00, LXK2-PE14-T00, LXK2-PE14-U00 LXK2-PB12-K00, LXK2-PB12-L00, LXK2-PB12-M00, LXK2-PB14-N00, LXK2-PB14-P00, LXK2-PB14-Q00 LXK2-PR12-L00, LXK2-PR12-M00, LXK2-PR14-Q00, LXK2-PR14-R00 LXK2-PD12-Q00, LXK2-PD12-R00, LXK2-PD12-S00 LXK2-PH12-R00, LXK2-PH12-S00 LXK2-PL12-P00, LXK2-PL12-Q00, LXK2-PL12-R00 Source: www.luxeon.com KINGBRIGHT: KA-3528ASYC Source: www.kingbright.com
Q7 = mylib:XTAL_CFPX-217: kHz RANGE CRYSTAL UNIT LOW PROFILE SMD Source: Epson Toyocom FC-12M.pdf
Q10 = adafruit:MOSFET-N: N-Channel Mosfet 2N7002E - 60V 260mA SOT23 [Digikey: 2N7002ET1GOSTR-ND] - REEL BSH103 - 30V 850mA SOT23 [Digikey: 568-5013-1-ND]
R1-R51 R55-R60 R63 R64 R66-R70 R72 R73 R82 = resistor:R-EU_: RESISTOR, European symbol
U1 = mylib:ESP32MOD: ESP32 Module Espressif
U$1-U$7 U$9 U$17 = mylib:IXYS_CPC1014N
U$8 = mylib:NEXPERIA_PMV74EPER
U$10 U$16 U$27 = mylib:TRIAD_FS24-045-C2
U$11 U$13 U$15 U$31 U$33 = mylib:FM4007W-W
U$12 = mylib:BOURNS_PEC12R-4225F-S0024
U$14 U$28 U$32 = mylib:R2512
U$18 = mylib:JAE_DX07S016JA1R1500
U$19 U$21 U$23 U$24 = mylib:FIDUCIAL: For use by pick and place machines to calibrate the vision/machine, 1mm By microbuilder.eu
U$20 = mylib:AMC3306M25
U$22 U$26 = mylib:BOURNS_ZV17K0603300NIR1HT
U$29 U$30 = mylib:KEYSTONE_FUSE_HOLDER_2PCS_5MMX20
U$34 = mylib:LXESXXA
U$35 = mylib:WUERTH_PINHEADER_7POL_61001018221
U$36 = mylib:TPS63025
U$38 = mylib:PHOENIX_PTSA1.5/7-3.5-Z
U$41 = mylib:LINX_BAT-HLD-001
U$42 = mylib:PCF8523
U$43 = mylib:OMRON_G6RL-14-ASI

## Board
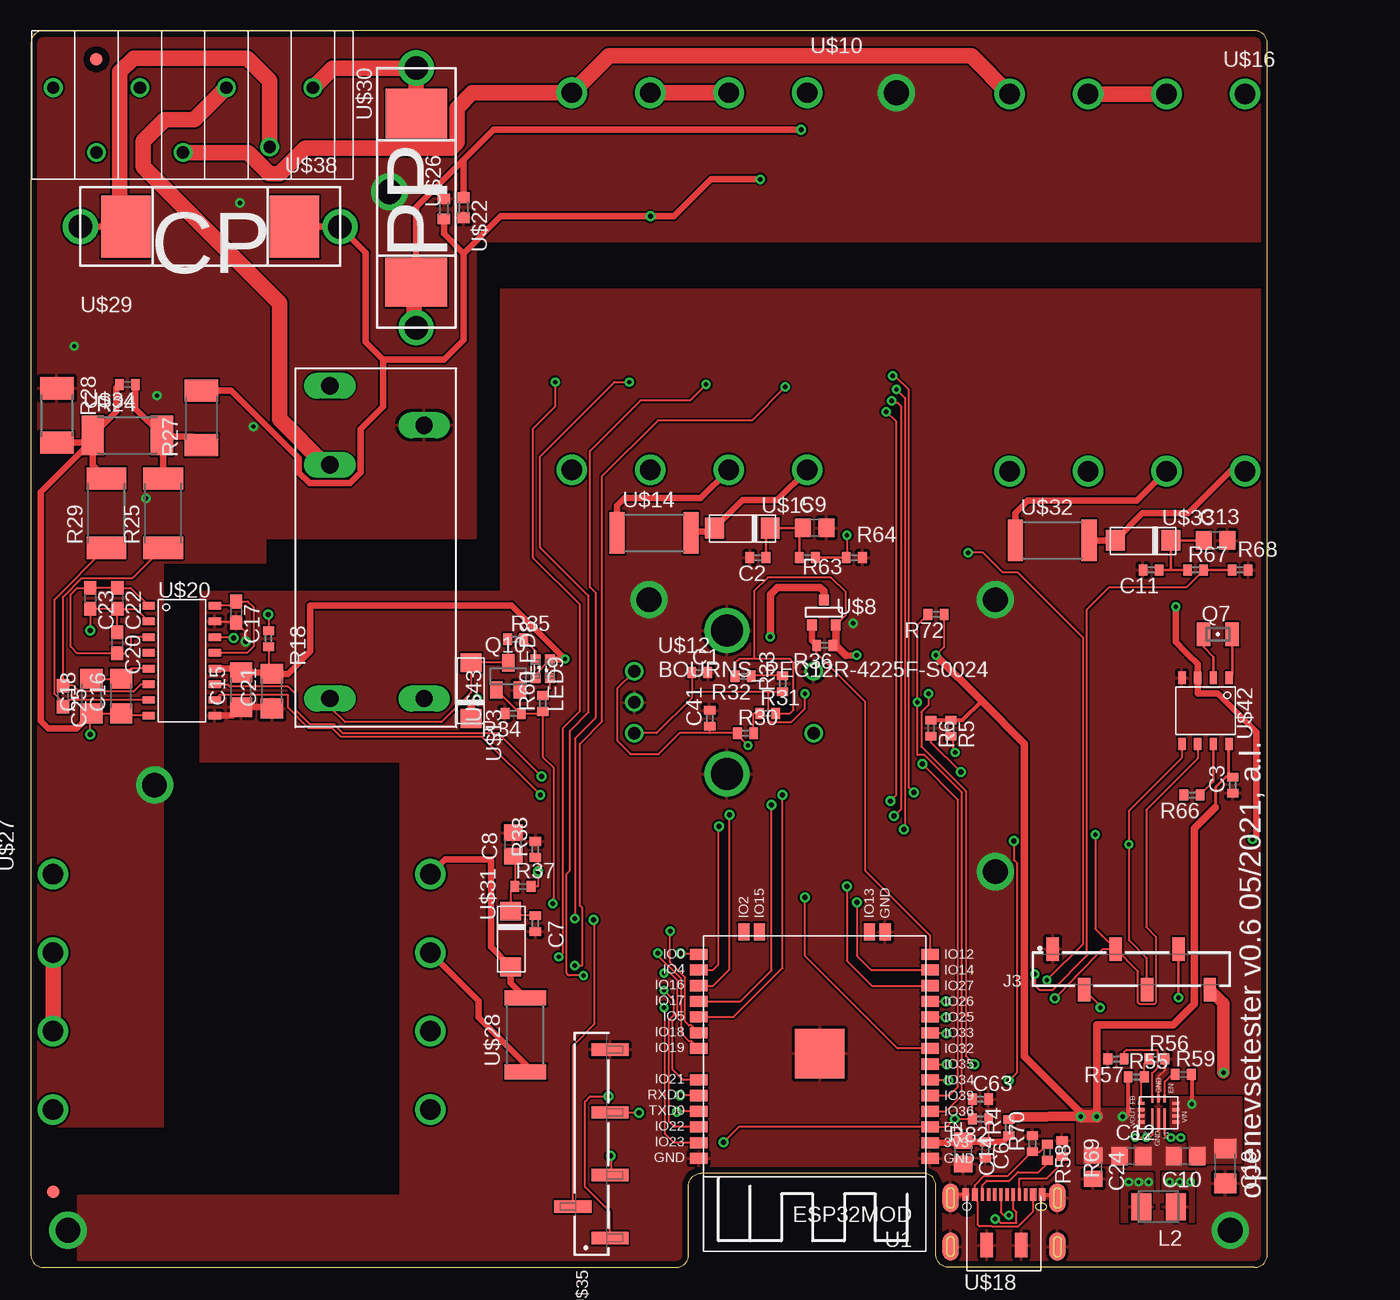
[diagram p7: board, top side]
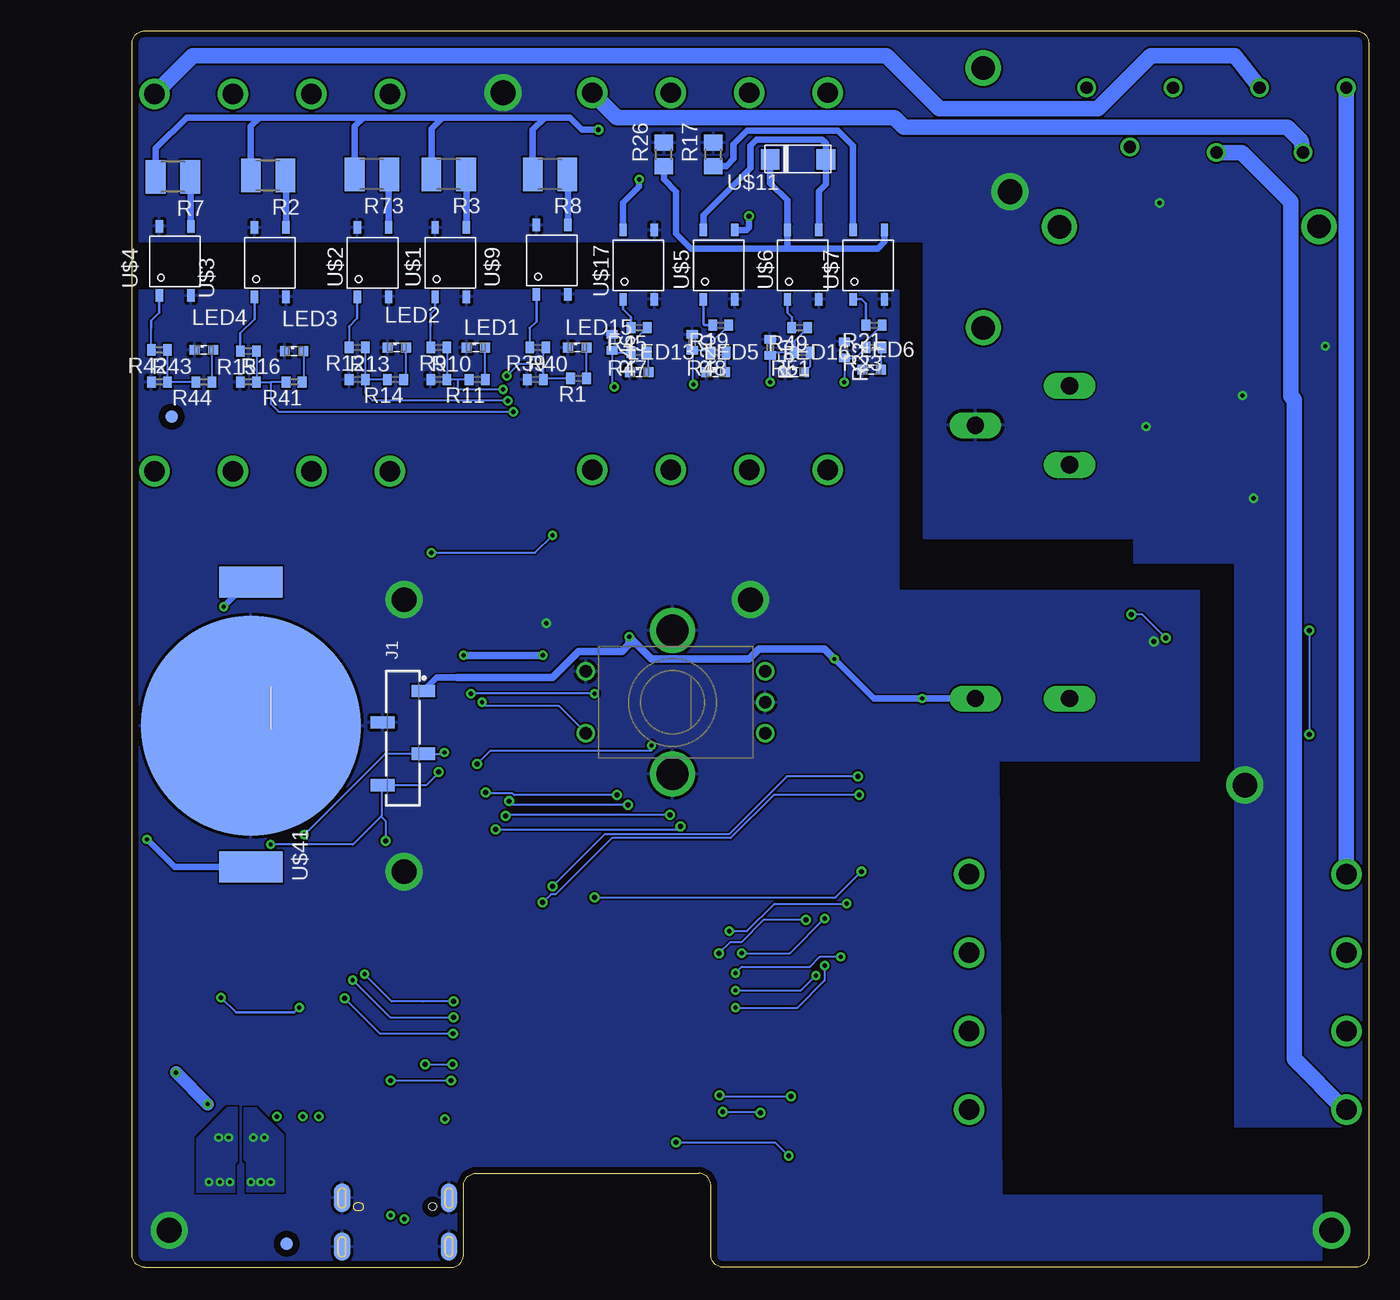
[diagram p8: board, bottom side, seen from below]

Size 100 x 100 mm. Coordinates in mm from the lower left corner, seen from the top.
Outline: 0,99 0,1 arc90 1,0 52.2,0 arc90 53.2,1 53.2,6.6 arc-90 54.2,7.6 72.2,7.6 arc-90 73.2,6.6 73.2,1 arc90 74.2,0 99,0 arc90 100,1 100,99 arc90 99,100 1,100 arc90 0,99
Copper layers (1*16): Top 0.035mm / dielectric 1.5mm / Bottom 0.035mm
Design rules "default *": minimum track width 6mil, minimum drill 0.3mm, track to track 6mil, track to pad 6mil, pad to pad 6mil, via to via 6mil, smd to smd 6mil, copper to edge 20mil, drill to drill 6mil, minimum pad ring 10mil, minimum via ring 8mil, stop-mask expansion 4mil, vias tented up to drill 0mil, thermal gap 10mil

### Footprints (pad centres in the part's own frame; a part is rotated, then mirrored left to right if it is on the bottom)
C0402 = smd 0.7 x 0.9: 1 -0.65,0; 2 0.65,0
C0805 = smd 1.3 x 1.5: 1 -0.95,0; 2 0.95,0
C1206 = smd 1.6 x 1.8: 1 -1.4,0; 2 1.4,0
C0603 = smd 1.1 x 1: 1 -0.85,0; 2 0.85,0
61000411921 = smd 1 x 1.91: 1 3.81,-1.645; 2 1.27,1.645; 3 -1.27,-1.645; 4 -3.81,1.645
61000611921 = smd 1 x 1.91: 1 6.35,-1.645; 2 3.81,1.645; 3 1.27,-1.645; 4 -1.27,1.645; 5 -3.81,-1.645; 6 -6.35,1.645
L3225M = smd 1.6 x 2.2: 1 -1.4,0; 2 1.4,0
SML0603 = smd 0.8 x 0.8: A 0.75,0; C -0.75,0
FC-12M = smd 1.1 x 1.9: 1 -1.15,0; 2 1.15,0
SOT23 = smd 1 x 1.4: 1 -0.95,-1.1; 2 0.95,-1.1; 3 0,1.1
R0402 = smd 0.7 x 0.9: 1 -0.65,0; 2 0.65,0
R1210 = smd 1.6 x 2.7: 1 -1.4,0; 2 1.4,0
R0805 = smd 1.3 x 1.5: 1 -0.95,0; 2 0.95,0
R2512 = smd 1.8 x 3.2: 1 -2.8,0; 2 2.8,0
R2010 = smd 1.8 x 2.7: 1 -2.2,0; 2 2.2,0
ESP32MOD = smd 4 x 4: 0 9.6,11.5 | smd 1.4 x 0.9: 1 0.68,19.99; 2 0.68,18.72; 3 0.68,17.45; 4 0.68,16.18; 5 0.68,14.91; 6 0.68,13.64; 7 0.68,12.37; 8 0.68,11.1; 9 0.68,9.83; 10 0.68,8.56; 11 0.68,7.29; 12 0.68,6.02; 13 0.68,4.75; 14 0.68,3.48; 25 19.38,3.48; 26 19.38,4.75; 27 19.38,6.02; 28 19.38,7.29; 29 19.38,8.56; 30 19.38,9.83; 31 19.38,11.1; 33 19.38,13.64; 34 19.38,14.91; 35 19.38,16.18; 36 19.38,17.45; 37 19.38,18.72; 38 19.38,19.99 | smd 0.9 x 1.4: 15 4.31,1.68; 16 5.58,1.68; 23 14.47,1.68; 24 15.74,1.68
SOIC-4 = smd 0.6 x 1: 1 0,0; 2 2.54,0; 3 2.54,5.6; 4 0,5.6
SOT23' = smd 0.787 x 0.889: 1 3.531,-0.254; 2 1.6,-0.254; 3 2.565,-2.286
TRIAD_FS24-045-C2 = drill 1.651: 1 0,0; 2 6.35,0; 3 12.7,0; 4 19.05,0; 5 0,30.505; 6 6.35,30.505; 7 12.7,30.505; 8 19.05,30.505
SMX = smd 1.52 x 1.68: ANODE 5.3,0; KATHODE 0.8,0
BOURNS_PEC12RXXX = drill 1: 1 0,14.5; 2 5,14.5; A 0,0; B 5,0; C 2.5,0 | drill 2.6: GND1 -3.3,7.5; GND2 8.3,7.5
2512 = smd 1.22 x 3.35: 1 -2.99,0; 2 2.99,0
JAE_DX07S016JA1R1500 = smd 0.52 x 1: A1/B12 -3.1,0.375; A4/B9 -2.35,0.375; A12/B1 3.1,0.375; B4/A9 2.35,0.375 | smd 0.27 x 1: A5 -1.75,0.375; A6 -0.25,0.375; A7 0.75,0.375; A8 1.75,0.375; B5 1.25,0.375; B6 0.25,0.375; B7 -0.75,0.375; B8 -1.25,0.375 | smd 1.3 x 2.3: G1 -4.32,-3.825; G2 4.32,-3.825; G3 4.32,0.125; G4 -4.32,0.125 | smd 1.3 x 2.3 bottom: G5 -4.32,0.125; G6 4.32,0.125; G7 4.32,-3.825; G8 -4.32,-3.825 | smd 1 x 2: P1 -1.4,-3.7; P2 1.4,-3.7 | hole 0.6: -3,-0.6
FIDUCIAL_1MM = smd 1 x 1: 1 0,0
SOIC-16 = smd 0.6 x 1: 1 -1.905,-2.675; 2 -0.635,-2.675; 3 0.635,-2.675; 4 1.905,-2.675; 5 3.175,-2.675; 6 4.445,-2.675; 7 5.715,-2.675; 8 6.985,-2.675; 9 6.985,2.675; 10 5.715,2.675; 11 4.445,2.675; 12 3.175,2.675; 13 1.905,2.675; 14 0.635,2.675; 15 -0.635,2.675; 16 -1.905,2.675
0603 = smd 0.87 x 0.98: 1 -0.815,0; 2 0.815,0
KEYSTONE_PC_5MM_FUSE_CLIP = drill 1.9: P$1 0,3.17; P$3 21,3.16 | smd 4 x 5: PAD1 3.68,3.17; PAD2 17.32,3.16
0402 = smd 0.7 x 0.9: 1 -0.65,0; 2 0.65,0
PINHEADER_SMD_7POL_ESP32_PRG = smd 1 x 3: 1 1.27,-0.23; 2 3.81,2.77; 3 6.35,-0.23; 5 11.43,-0.23; 7 16.51,-0.23
VQFN14 = smd 0.6 x 0.24: EN 1.15,-0.5; GND 1.15,0; PFM/PWM 1.115,0.5 | smd 0.24 x 0.6: FB 0.75,1.4; VIN1 -0.75,-1.4; VIN2 -0.25,-1.4; VIN3 0.25,-1.4; VINA 0.75,-1.4; VOUT1 0.25,1.4; VOUT2 -0.25,1.4; VOUT3 -0.75,1.4 | smd 1.79 x 0.24: L1 -0.555,-0.49; L2 -0.555,0.49; PGND -0.555,0
PHOENIX_PTSA_7POL_3.5MM = drill 1: 1 1.75,4.6; 2 5.25,9.4; 3 8.75,4.6; 4 12.25,9.85; 5 15.75,4.6; 6 19.25,9.85; 7 22.75,4.6
BATTERY_HOLDER_CR2032 = smd 2.5 x 5.1: P$1 -11.43,0; P$2 11.64,0 | smd 17.8 x 17.8: P$3 0,0
SOIC-8 = smd 0.6 x 1: 1 -1.905,-2.675; 2 -0.635,-2.675; 3 0.635,-2.675; 4 1.905,-2.675; 5 1.905,2.675; 6 0.635,2.675; 7 -0.635,2.675; 8 -1.905,2.675
OMRON_G6RL-14-ASI = drill 1.4 long: 1 0,0; 2 22.1,0; 3 25.3,7.62; 4 18.9,7.62; 5 0,7.62

### Placement (x,y rotation side)
C1  54.1,48.1 0 top
C2  58.8,57.4 180 top
C3  97.2,39 90 top
C6  77.2,9.5 270 top
C7  40.8,27.8 270 top
C8  39,34.2 90 top
C9  63.4,59.8 0 top
C10  93.4,9 180 top
C11  90.6,56.4 180 top
C12  89,9 0 top
C13  95.8,58.8 0 top
C14  75.4,9.3 270 top
C15  17,46.7 90 top
C16  7.3,46.2 90 top
C17  16.6,53 270 top
C18  4.9,46.2 90 top
C19  96.6,8.2 270 top
C20  6.97,50.51 270 top
C21  19.5,46.6 90 top
C22  7,54.1 270 top
C23  4.8,54.1 270 top
C24  85.9,8.1 270 top
C25  2.6,46.2 270 top
C41  54.9,44.4 90 top
C63  76.8,13.6 0 top
J1  78.1,42.8 90 bottom
J3  89,24.1 180 top
L2  91.2,4.9 180 top
LED1  72.2,74.4 0 bottom
LED2  78.6,74.4 0 bottom
LED3  86.9,74.1 0 bottom
LED4  94.2,74.2 0 bottom
LED5  52.8,72.4 0 bottom
LED6  40.2,72.6 0 bottom
LED8  42,48.4 90 top
LED9  40.8,48.4 270 top
LED13  59,72.4 0 bottom
LED15  64,74.4 0 bottom
LED16  46.4,72.4 0 bottom
Q7  96,51.2 0 top
Q10  38.6,47.8 0 top
R1  63.9,71.9 180 bottom
R2  89,88.3 180 bottom
R3  74.4,88.4 180 bottom
R4  79.1,11.3 90 top
R5  74.4,43.6 270 top
R6  72.8,43.6 270 top
R7  96.7,88.2 180 bottom
R8  66.2,88.4 180 bottom
R9  75.2,74.4 180 bottom
R10  75.2,71.8 0 bottom
R11  72.1,71.8 180 bottom
R12  81.8,74.4 180 bottom
R13  81.8,71.8 0 bottom
R14  78.7,71.8 180 bottom
R15  90.6,74.1 180 bottom
R16  90.6,71.6 0 bottom
R17  53,90 90 bottom
R18  19.22,50.84 270 top
R19  52.4,76.2 180 bottom
R20  54.7,74.8 270 bottom
R21  40,76.2 180 bottom
R22  42.4,74.2 270 bottom
R23  40,74.4 180 bottom
R24  7.8,67.3 0 top
R25  10.7,61 90 top
R26  57,90 90 bottom
R27  13.8,68.7 90 top
R28  2.1,68.9 270 top
R29  6.1,61 90 top
R30  57.8,43.2 0 top
R31  59.6,44.8 0 top
R32  57.6,47.8 180 top
R33  60.8,47.2 90 top
R34  39,44.8 180 top
R35  39.2,50.8 0 top
R36  64.2,50.3 180 top
R37  39.8,30.8 0 top
R38  40.8,33.8 90 top
R39  67.2,74.4 180 bottom
R40  67.4,71.8 0 bottom
R41  86.9,71.6 180 bottom
R42  97.8,74.2 180 bottom
R43  97.8,71.6 0 bottom
R44  94.2,71.6 180 bottom
R45  59,76 180 bottom
R46  61.2,74.8 270 bottom
R47  59,74 180 bottom
R48  52.6,74 180 bottom
R49  46,76 180 bottom
R50  48.4,74.4 270 bottom
R51  45.8,74 180 bottom
R55  89.4,15.4 0 top
R56  91.06,16.85 0 top
R57  87.76,16.84 180 top
R58  82.2,9.3 270 top
R59  93.2,15.6 0 top
R60  41.4,45.6 90 top
R63  62.8,57.4 0 top
R64  66.6,57.4 0 top
R66  93.9,38.2 180 top
R67  94.2,56.4 0 top
R68  97.8,56.4 0 top
R69  83.4,9.6 270 top
R70  81,10 90 top
R72  73.2,52.8 180 top
R73  80.6,88.4 180 bottom
R82  76.8,12 180 top
U1  73.4,28.8 180 top
U$1  75.5,78.5 0 bottom
U$2  81.8,78.5 0 bottom
U$3  90.1,78.5 0 bottom
U$4  97.8,78.6 0 bottom
U$5  53.8,78.3 0 bottom
U$6  47,78.3 0 bottom
U$7  41.7,78.3 0 bottom
U$8  NEXPERIA_PMV74EPER  [SOT23']  66.7,51.7 180 top
U$9  67.3,78.7 0 bottom
U$10  62.8,95 180 top
U$11  49.2,89.6 0 bottom
U$12  48.8,43.2 90 bottom
U$13  35.6,43.6 90 top
U$14  50.4,59.4 0 top
U$15  60.6,59.8 180 top
U$16  98.2,94.9 180 top
U$17  60.3,78.3 0 bottom
U$18  78.7,5.5 0 top
U$19  5.3,97.7 0 top
U$20  12.2,51.6 270 top
U$21  96.8,68.8 0 bottom
U$22  35,85.7 270 top
U$23  1.8,6.1 0 top
U$24  87.5,1.9 180 bottom
U$26  33.4,85.6 90 top
U$27  1.8,31.8 270 top
U$28  40,18.8 90 top
U$29  4,81 0 top
U$30  28,97 270 top
U$31  38.8,29.6 270 top
U$32  82.6,58.8 0 top
U$33  93,58.8 180 top
U$34  7.8,71.4 180 top
U$35  46.6,1.1 90 top
U$36  91.2,12.5 90 top
U$38  24.56,100.01 180 top
U$41  90.4,43.8 90 bottom
U$42  95,45 180 top
U$43  31.8,46 90 top

### Tracks (layer width: path | path; a pad name or v marks a point on that pad's centre or on a via)
+3V2
  Top 0.2: 62,59.8 U$15.KATHODE 59.45,59.45 C2.1 | 62,59.8 C9.1 | R63.1 62.15,59.65 62,59.8
+3V3  (via drill 0.35)
  Top 0.152: LED8.A 40.8,47.95 LED9.A | R18.2 19.22,48.32 19,48.1
  Top 0.508: LED8.A 43.15,49.15 v43.2,49.2 38.86,53.54 22.6,53.54 22.6,49.81 20.79,48 C21.2 19.4,48.1 19,48.1 C15.2 16.68,48.42 U$20.12
  Top 0.61: U$13.KATHODE 35.6,45.5 v36.1,46 | U$8.3 64.14,54.69 63.84,54.99 60.39,54.99 59.8,54.4 v59.8,51
  Bottom 0.508: v43.2,49.2 40,46 v36.1,46 U$43.1 | J1.1 75.36,47.7 73.7,47.7
  Bottom 0.61: 73.7,47.7 66,47.7 63.9,49.8 60.4,49.8 59.8,50.4 v59.8,51 58,49.2 50.1,49.2 49.3,50 44,50 v43.2,49.2
+3V3_PERMANENT  (via drill 0.35)
  Top 0.152: R32.2 57,47.8 57,48.9 57.3,49.2 58.5,49.2 | 58.5,49.2 61.4,49.2 61.68,48.92 61.68,45.08 61.4,44.8 R31.2 | 96.91,39.95 U$42.8 96.91,42.4 | R72.1 73.85,50.15 v73.2,49.5 | U$8.2 65.9,52.75 65.9,54.6 64.7,55.8 59.6,55.8 58.5,54.7 58.5,49.2 | 79.58,12.13 79.28,12.13 R4.2
  Top 0.254: 95.8,37.2 95.8,38.8 96.65,39.65 C3.2 96.91,39.95 96.91,42.4
  Top 0.305: v88.3,12.2 88.6,12.2 88.75,12.35 R55.1 | R6.1 R5.1 75.35,44.25 76.9,45.8
  Top 0.508: 65.91,49.5 v66.8,49.5
  Top 0.61: v86.2,12.2 86.2,19.6 92.4,19.6 94.1,21.3 94.1,35.5 95.8,37.2 | v84.9,12.2 84.9,12.5 80.36,17.04 80.36,42.34 76.9,45.8 v73.2,49.5 | 65.91,49.5 65.11,50.3 R36.1 65.1,50.55 U$8.2
  Top 0.813: v84.9,12.2 79.58,12.13
  Top 1.016: v84.9,12.2 v86.2,12.2
  Bottom 0.61: v73.2,49.5 v66.8,49.5
  pour Top (rank 2, no thermals): 90.1,12.8 84.6,12.8 84.6,8.4 89.2,8.4 89.2,10.3 90.1,11.2
+3V4
  Top 0.2: R67.1 92.2,56.4 | 92.2,56.4 C11.1 | 92.2,56.4 U$33.KATHODE C13.1
AAA  (via drill 0.35, 0.4, 2)
  Top 0.152: R56.2 91.72,15.95 91.2,15.43 U$36.GND | U$20.15 16.52,52.23 C17.2 17.36,51.39 v17.36,50.6
  Top 0.305: U$18.A12/B1 82.77,5.88 U$18.G6 | U$18.A1/B12 74.63,5.88 U$18.G5
  Top 0.508: U$20.9 16.32,44.62 C15.1 19.4,45.3 C21.1
  other vias: 3,3 50,54 97,3 66.5,52.1 78,32 78,54
  pour Bottom (rank 5): 13.7,54.7 38,54.7 38,79 100,79 100,0 3.8,0 3.8,5.8 29.68,5.8 29.91,41 13.7,41
  pour Top (rank 5): 100,0 100,79.08 38,79.08 38,54.6 13.7,54.6 13.7,40.91 29.85,40.91 29.85,5.8 3.8,5.8 3.8,0.4 4.2,0
  pour Top (no thermals): 91.5,13 90.9,13 90.9,10.4 89.2,10.4 89.2,8 93.4,8 93.4,10.4 91.5,10.4
ADC_CLKIN  (via drill 0.4)
  Top 0.152: U$20.11 15.92,47.16 16.11,46.97 20.8,46.97 21.41,46.37 21.41,45.09 22.59,43.91 24.53,43.91 25.23,43.2 37.8,43.2 v41.3,39.7 | v66,30.8 66,24.8 68.02,22.78 U1.12
  Bottom 0.152: v41.3,39.7 47.04,39.7 51.72,35.02 61.78,35.02 v66,30.8
ADC_DIAG  (via drill 0.4)
  Top 0.152: U$20.14 16.34,50.97 v16.4,50.9 | v19.2,52.8 19.22,52.78 R18.1
  Bottom 0.152: v16.4,50.9 18.3,52.8 v19.2,52.8
ADC_DOUT  (via drill 0.4)
  Top 0.152: U$20.10 15.32,46.33 20.8,46.33 20.8,45.27 22.47,43.6 24.4,43.6 25.11,42.9 36.51,42.9 v41.2,38.2 | v66.8,29.5 66.8,25.2 67.95,24.05 U1.13
  Bottom 0.152: v41.2,38.2 48.11,38.2 51.6,34.71 61.19,34.71 65.74,30.17 66.13,30.17 v66.8,29.5
CP  (via drill 0.35, 0.4)
  Top 0.508: v59,88 55,88 52,85 v50.1,85 38,85 35,82 | 35,82 35,75 33.4,73.4 28.5,73.4 | U$26.1 33.4,83.6 35,82 | 28.5,73.4 27.09,74.81 27.09,82.07 U$29.P$3 U$29.PAD2 | R27.2 16.21,70.9 21.67,65.44 21.67,64.3 22.53,63.44 25.83,63.44 26.69,64.3 26.69,67.79 28.5,69.6 28.5,73.4
  Bottom 0.508: v59,88 59,87.4 60.3,86.1 U$17.4 | v50.1,85 50.1,84.1 50.3,83.9 U$5.3
CP_IN
  Top 0.508: U$29.PAD1 7.6,84.17 | 7.6,84.17 U$29.P$1 | 7.2,87.1 7.2,84.57 7.6,84.17
  Top 1.27: U$38.2 19.31,95.99 17.5,97.8 8.3,97.8 7.2,96.7 7.2,87.1 7.2,85.44
EN  (via drill 0.35, 0.4)
  Top 0.152: C63.1 R82.2 v74.7,12 74.05,11.35 U1.3 57.25,11.35 v56,10.1 | v46.9,9 46.9,7.52 U$35.3
  Bottom 0.152: v56,10.1 48,10.1 v46.9,9
ESP32_VCC
  Top 0.152: 75.23,10.08 C14.1 | R82.1 77.45,10.4 C6.1
  Top 0.508: U1.2 75.23,10.08 75.3,10.15 C6.1 78.6,10.15 R4.1
GPIO0  (via drill 0.4)
  Top 0.152: U$35.2 43.83,17.93 45.6,19.7 45.6,28 v45.5,28.1 | v52.53,25.4 53.94,25.4 U1.25
  Bottom 0.152: v45.5,28.1 48.93,28.1 50.73,26.3 51.65,26.3 v52.53,25.41 v52.53,25.4
GPIO_3V3_SWITCH
  Top 0.152: R36.2 63.55,49.67 67.47,45.75 67.47,32.1 72.72,26.85 U1.14
  Top 0.508: U$8.1 63.17,50.68 R36.2
GPIO_L1  (via drill 0.4)
  Top 0.152: R37.2 41,30.8 v41,32 41,32.95 R38.1 | U1.8 70.1,17.7 62.6,25.2 v62.6,29.9
  Bottom 0.152: v62.6,29.9 43.1,29.9 v41,32
GPIO_L2  (via drill 0.35, 0.4)
  Top 0.152: v75.8,57.8 77,57.8 78.61,56.2 79.81,56.2 85.11,50.9 85.11,26.17 v82.17,23.23 | v66,59.2 66,57.45 R64.1 | U1.10 73.96,20.24 v74,20.2
  Top 0.2: R63.2 R64.1
  Bottom 0.152: v75.8,57.8 67.4,57.8 v66,59.2 | v82.17,23.23 79.13,20.2 v74,20.2
GPIO_L3  (via drill 0.35, 0.4)
  Top 0.152: R67.2 93.45,55 87.2,55 85.41,53.21 85.41,25.21 82.6,22.4 81.6,22.4 81.2,22.8 v81.2,23.7 | U1.11 v73.99,21.51 v74,21.5
  Top 0.2: R68.1 R67.2
  Bottom 0.152: v74,21.5 76.51,21.5 76.5,21.5 79,21.5 v81.2,23.7
GPIO_PE_BREAKER  (via drill 0.35)
  Top 0.152: v42.2,29.4 42.2,29.8 42.3,29.89 42.3,40.4 41.4,41.3 R60.1 41.25,44.8 R34.1 39.55,44.8 Q10.1 | U1.30 53.43,19.56 53.23,19.56 52.91,19.87 52.91,23.45 51.7,24.66 v51.7,27.2
  Bottom 0.152: v51.7,27.2 50.26,27.2 48.05,29.41 v42.21,29.41 v42.2,29.4
GPIO_PP1  (via drill 0.35, 0.4)
  Top 0.152: v69.7,72.1 69.9,72.1 71,71 71,38.8 v71.4,38.4 | U1.29 56.84,20.24 60.8,24.2 v60.8,38.2
  Bottom 0.152: R39.1 66.75,74.2 R40.2 | R1.2 66.73,71.9 66.75,71.88 R40.2 | v69.7,72.1 68.7,73.1 66.75,73.1 R40.2 | v60.8,38.2 69.11,38.2 69.24,38.33 71.33,38.33 v71.4,38.4
GPIO_PP2  (via drill 0.35, 0.4)
  Top 0.152: v70,71 70.69,70.31 70.69,35.49 v70.6,35.4 | U1.26 55.15,24.05 55.6,24.5 55.6,35.4 55.5,35.5 v55.65,35.65
  Bottom 0.152: R9.1 R10.2 73.7,71.8 | v70,71 73.7,71 73.7,71.8 | R11.2 73.7,71.8 | v70.6,35.4 55.9,35.4 v55.65,35.65
GPIO_PP3  (via drill 0.35, 0.4)
  Top 0.152: v69.62,70.09 69.81,69.91 70.12,69.91 70.39,69.63 70.39,37.09 v69.8,36.5 | U1.27 55.18,22.78 56.5,24.1 v56.5,36.6
  Bottom 0.152: R12.1 R13.2 | v69.62,70.09 80.56,70.09 81.15,70.68 R13.2 | R14.2 R13.2 | v56.5,36.6 69.7,36.6 v69.8,36.5
GPIO_PP4  (via drill 0.35, 0.4)
  Top 0.152: v69.17,69.2 69.99,68.38 69.99,38.19 v69.5,37.7 | U1.28 57.41,21.51 59.9,24 v59.9,37.4
  Bottom 0.152: R15.1 R16.2 88.8,71.6 | R41.2 88.8,71.6 | v69.17,69.2 88.17,69.2 88.81,69.84 88.8,69.85 88.8,71.6 | v59.9,37.4 69.2,37.4 v69.5,37.7
GPIO_PP5
  Bottom 0.152: R42.1 R43.2 R44.2
GPIO_ROTARY_A  (via drill 0.35, 0.4)
  Top 0.152: U$12.B 47.42,46.82 47.42,42.59 48.49,41.52 50.77,41.52 52.45,43.2 54.9,43.2 | v58,42.2 57.15,43.05 R30.1 54.9,43.2 | C41.1 54.9,43.2 | U1.5 74.28,13.89 75,14.6 75,37.8 v72.1,40.7
  Bottom 0.152: v58,42.2 58,41.8 70.9,41.8 71,41.8 v72.1,40.7
GPIO_ROTARY_B  (via drill 0.35, 0.4)
  Top 0.152: U$12.A 50.6,43.2 53.45,46.05 53.45,46.5 | v72.6,46.4 72.6,45.47 72.02,44.9 72.02,42.11 75.61,38.53 75.61,17.09 v76.3,16.4 | C1.1 53.45,46.5 | R33.1 59.6,46.55 | 59.6,46.55 53.5,46.55 53.45,46.5 | 59.6,46.55 59.67,46.48 59.67,44.26 59.8,44.12 61.52,44.12 62.6,45.2 v62.6,46.4 | U1.7 v74.1,16.43
  Bottom 0.152: v62.6,46.4 v72.6,46.4 | v76.3,16.4 74.13,16.4 v74.1,16.43
GPIO_ROTARY_BUTTON  (via drill 0.35)
  Top 0.152: R72.2 71.7,51.95 v71.7,45.7 71.7,41.42 72.28,41.42 75.3,38.4 75.3,13.9 74.02,12.62 U1.4
  Bottom 0.152: v71.7,45.7 71.7,45.39 65.49,45.39 U$12.1
GPIO_STATE_AB  (via drill 0.35)
  Top 0.152: v44,28.2 44,42.77 45.7,44.47 45.7,54.53 45.22,55.01 45.22,66.02 49.3,70.11 53.3,70.11 v54.6,71.4 | U1.31 53.43,18.29 53.23,18.29 52.61,18.91 52.61,23.32 50.62,25.32 v50.7,25.4
  Bottom 0.152: v50.7,25.4 46.8,25.4 v44,28.2 | R19.1 53.25,74.7 R48.2 53.4,74.15 R20.2 54.7,71.5 v54.6,71.4
GPIO_STATE_C  (via drill 0.35)
  Top 0.152: v42.7,25.1 43,25.4 43,43.6 44.4,45 44.4,53.6 40.58,57.42 40.58,67.81 42.4,69.63 v42.4,71.6 | U1.33 52.75,15.16 51.91,16 51.91,19.88 52.3,20.27 52.3,21.73 52.3,23.2 51.7,23.8 v51.2,23.8
  Bottom 0.152: v51.2,23.8 50.7,24.3 45.2,24.3 44.4,25.1 v42.7,25.1 | R21.1 40.65,74.9 R23.2 41.5,73.55 R22.2 v42.4,71.6
GPIO_STATE_D_FAULT  (via drill 0.35)
  Top 0.152: v44.7,23.6 43.5,23.6 43.31,23.79 43.31,31.81 43.59,32.1 43.59,43.39 45.1,44.91 45.1,54.3 41.18,58.22 41.18,65.58 47.2,71.6 v48.4,71.6 | U1.36 52.05,11.35 51.6,11.8 51.6,20 52,20.4 52,21.6 v51.2,22.4
  Bottom 0.152: v51.2,22.4 45.9,22.4 v44.7,23.6 | R49.1 46.45,74.9 R51.2 48.15,74 R50.2 v48.4,71.6
GPIO_STATE_E  (via drill 0.35)
  Top 0.152: v51.2,21 51.3,20.9 51.3,10.8 52.02,10.08 U1.37 | v44,24.4 44.61,24.4 44.61,29.05 44.4,29.26 44.4,42.34 46.21,44.15 46.21,64.01 50.7,68.5 58.3,68.5 v61,71.2
  Bottom 0.152: v51.2,21 46.2,21 44,23.2 v44,24.4 | R45.1 59.65,74.7 R47.2 61.05,74 R46.2 61.2,71.4 v61,71.2
L1
  Bottom 1.27: U$38.7 1.81,85.11 1.79,85.09 1.79,31.81 U$27.1
L2
  Bottom 1.27: U$38.6 5.43,91.08 6.58,92.23 37.6,92.23 38.35,92.97 60.77,92.97 U$10.1
L3
  Bottom 1.27: U$16.1 95.1,98 39,98 34.7,93.7 21.9,93.7 17.6,98 10.81,98 U$38.5
L13V3  (via drill 0.3)
  Top 0.152: U$36.L1 91.69,10.71 91.9,10.5 v92.2,10.5 v93,10.5
  other vias: 93.8,6.9 92.9,6.9 92.1,6.9
  pour Bottom: 91.5,12.9 92.3,12.9 94.8,10.4 94.8,6.1 91.7,6.1 91.7,8.4 91.5,8.6
  pour Top: 94.1,3.7 94.1,7.5 94,7.6 91.5,7.6 91.5,3.7
L23V3  (via drill 0.3)
  Top 0.152: U$36.L2 90.71,10.71 90.5,10.5 v90.2,10.5 v89.3,10.5
  other vias: 90.4,6.9 89.6,6.9 88.8,6.9
  pour Bottom: 90.9,12.9 90,12.9 87.8,10.7 87.8,6.1 90.7,6.1 90.7,8.5 90.9,8.7
  pour Top: 90.8,3.7 90.8,7.5 90.7,7.6 88.2,7.6 88.2,3.7
N
  Top 1.27: U$16.4 76.05,98 46.75,98 U$10.4 35.7,95 34.46,93.76 34.46,90.99 34,90.53 22.16,90.53 20.1,88.47 19.27,88.47 17.58,90.16 U$38.4
  Bottom 1.27: U$27.4 1.92,12.75 6.03,16.86 6.03,70.2 6.3,70.47 6.3,86.2 10.26,90.16 U$38.4
N$1
  Top 0.152: R35.2 40.8,49.85 LED9.C
N$2
  Top 1.27: U$10.3 U$10.2
N$3
  Top 0.2: 53.49,59.51 U$14.2
  Top 0.508: U$10.5 60.35,62.05 57.55,62.05 U$15.ANODE 55.01,59.51 53.49,59.51
N$4
  Bottom 0.152: R9.2 75.85,76.15
  Bottom 0.2: 75.85,76.15 75.85,77.15 75.5,77.5 U$1.1
N$5
  Bottom 0.152: R11.1 LED1.A
N$6
  Top 0.508: U$14.1 47.41,61.61 48,62.2 54.16,62.2 U$10.6
N$7
  Bottom 0.152: 82.45,76.1 R12.2
  Bottom 0.2: U$2.1 81.8,76.75 82.45,76.1
N$8
  Top 1.27: U$16.3 U$16.2
N$9
  Top 0.508: U$32.2 U$33.ANODE 89.9,61 93.6,61 97,64.39 U$16.5
N$10
  Bottom 0.152: LED2.A 77.85,71.8 R14.1
N$11
  Bottom 0.2: U$3.1 90.1,76.7 91.25,75.55 R15.2
N$12
  Bottom 0.152: LED3.A 86.15,71.7 R41.1
N$13
  Bottom 0.152: R42.2 98.45,75.95
  Bottom 0.2: 98.45,75.95 98.45,76.55 97.8,77.2 U$4.1
N$14
  Top 0.152: R35.1 38.6,50.75 Q10.3 U$13.ANODE 35.6,46.5 33.2,44.1 25.4,44.1 24.18,45.32 U$43.5
N$15
  Top 0.2: 80.6,62 80.5,61.9
  Top 0.508: U$16.6 89.45,62 80.6,62 | 80.5,61.9 79.61,61.01 U$32.1
N$16
  Bottom 0.152: 67.85,75.95 R39.2
  Bottom 0.2: U$9.1 67.3,76.5 67.85,75.95
N$17
  Bottom 0.152: R1.1 63.4,72.05 63.35,72.15 63.25,72.25 LED15.A
N$18
  Bottom 0.152: LED4.A 93.73,74.04 93.45,74.33 93.55,74.12 R44.1
N$19
  Bottom 0.2: R45.2 59.65,76.85 60.3,77.5 U$17.1
N$20
  Bottom 0.2: U$5.1 53.8,76.3 53.7,76.2 R19.2
N$21
  Bottom 0.2: R21.2 40.65,77.95 41,78.3 U$7.1
N$22
  Bottom 0.152: R23.1 39.45,74.3 LED6.A
N$23
  Top 0.152: R60.2 42,46.85 LED8.C
N$25
  Bottom 0.152: R48.1 52.05,73.9 LED5.A
N$26
  Bottom 0.508: U$5.4 53.8,85.1 50,88.9 50,90.7 49.5,91.2 44.2,91.2 43.9,90.9 U$11.ANODE 43.9,87.6 44.46,87.04 U$6.3
N$30
  Bottom 0.152: LED13.A 58.25,73.9 R47.1
N$31
  Bottom 0.2: R49.2 46.65,76.85 47,77.2 U$6.1
N$32
  Bottom 0.152: LED16.A 45.15,72.9 R51.1
N$33  (via drill 0.35)
  Top 0.2: J3.5 v92.81,21.81 | J3.2 86.49,21.16 v86.49,21.01
  Bottom 0.2: v92.81,21.81 91.6,20.6 86.9,20.6 v86.49,21.01
N$34
  Top 0.152: C8.1 39.15,33.1 R37.1 38.8,30.45 U$31.KATHODE 39.15,28.45 C7.1
N$36
  Top 0.152: U$36.EN 91.7,15 92.3,15.6 R59.1
N$37
  Top 0.152: U$20.16 16.25,53.51 C17.1 17.55,53.85 18,53.4 18,50.2 17.5,49.7 U$20.13
N$38
  Top 0.152: R56.1 90.05,16.48 R55.2 89.8,15.15 U$36.FB
N$39
  Top 0.152: R69.2 83.4,8.43 82.17,7.2 79.95,7.2 U$18.B5
N$40
  Top 0.152: R30.2 58.45,44.77 R31.1
N$41
  Top 0.152: R33.2 58.3,47.85 R32.1
N$42
  Top 0.152: U$20.6 8.88,47.16 8.29,46.57 3.9,46.57 3.43,47.05 C25.1 2.6,54.23 4.1,55.73 8.23,55.73 R25.1
N$43
  Top 0.152: U$36.PFM/PWM 90.7,15.7 91.1,16.1 91.1,17.6 88.6,17.6 88.41,17.41 R57.1
N$44
  Top 1.27: U$27.2 U$27.3
N$46
  Top 0.508: U$28.2 38.8,22.99 U$31.ANODE 37.2,25.9 37.2,33 33.51,33 U$27.5
N$47
  Top 0.508: U$27.6 36.2,21.55 36.2,20.2 40,16.4 U$28.1
N$48
  Top 0.508: R25.2 10.7,67.2 | 10.7,67.2 R24.2 8.45,69.45 U$34.1 | R27.1 13.1,67.2 10.7,67.2
N$49
  Top 0.152: U$20.7 3.13,45.88 C25.2 2.6,45.68 1.87,46.41 1.87,53.97 R29.1
N$50  (via drill 0.4)
  Top 0.152: U$20.2 8.51,53.25 C22.2 6.9,53.25 | 6.9,53.25 C23.2 v4.8,51.5 | C20.1 6.97,53.17 6.9,53.25 | U$20.8 7.49,44.62 C16.1 C18.1 4.8,44.7 v4.8,43.1
  Top 0.508: R29.2 5,64.9 5,66.9 | 5,66.9 R24.1 | R28.2 4.4,66.7 R24.1 | U$34.2 6.9,71.15 6.9,69.2 R24.1 | C18.1 3.7,43.6 1.4,43.6 0.8,44.2 0.8,62.7 5,66.9
  Bottom 0.152: v4.8,51.5 v4.8,43.1
N$52
  Top 0.152: U$20.5 8.12,48.42 7.45,47.75 C16.2 C18.2
N$54
  Top 0.152: U$20.1 8.08,54.95 C22.1 C23.1 3.75,54.95 3.2,54.4 3.2,50.2 3.74,49.66 C20.2 7.56,49.66 8.1,50.2 8.1,51 9.49,51 U$20.3
N$98
  pour Top: 91.6,14.1 91.6,14.2 91.4,14.4 91.4,17.4 91.3,17.5 90.5,17.5 90.4,17.4 90.4,16.6 91,16 91,14.4 90.8,14.2 90.8,14.1
N$99
  Top 0.2: U$42.1 97.15,47.92 Q7.2
N$100
  Top 0.2: Q7.1 94.85,50.15 95.64,49.37 U$42.2
N$101
  Top 0.2: U$42.7 95.64,39.28 R66.1
PE  (via drill 0.35, 2)
  other vias: 70,95 18,68 10.2,70.5 3.5,74.5 16.9,86.1 9.3,62.2 29,87 10,39
  pour Top: 0,100 0,11.42 10.7,11.42 10.7,57 19,57 19,59 36,59 36,83 100,83 100,100
  pour Bottom: 0,100 100.08,100 100.08,83 36,83 36,59 19,59 19,57 10.8,57 10.8,11.4 0,11.4
PE_IN
  Top 1.27: U$38.3 13.2,92.8 10.8,92.8 9.1,91.1 9.1,89 20.1,78 20.1,68.6 23.8,64.9 U$43.4
PP  (via drill 0.4)
  Top 0.2: U$30.PAD2 31.16,79.84 31,80
  Top 0.508: U$30.PAD2 31.16,85.76 35,89.6 | 35,89.6 37.4,92 v62.3,92 | U$22.1 35,89.6
  Top 1.27: U$30.P$3 31,76.16 31,80
  Bottom 0.508: 66.6,93 64.6,93 63.6,92 v62.3,92 | 66.6,93 74.9,93 | 74.9,93 81.3,93 | 81.3,93 89.7,93 | 89.7,93 95.6,93 98.1,90.5 R7.2 | R8.2 67.6,92 66.6,93 | R3.2 75.8,92.1 74.9,93 | R73.2 82,92.3 81.3,93 | R2.2 90.4,92.3 89.7,93
PP1
  Bottom 0.508: U$9.3 64.76,88.36 R8.1
PP2
  Bottom 0.508: U$1.3 72.96,88.36 R3.1
PP3
  Bottom 0.508: U$2.3 79.26,88.34 R73.1
PP4
  Bottom 0.508: U$3.3 87.56,88.26 R2.1
PP5
  Bottom 0.508: U$4.3 95.26,88.16 R7.1
PP6
  Bottom 0.508: R17.1 51.95,89.05 51.35,89.65 51.35,90.85 50.27,91.93 42.93,91.93 41.7,90.7 U$7.4
PP7
  Bottom 0.508: R26.1 57,88 56,87 56,83.6 54.8,82.4 47,82.4 | U$7.3 39.16,82.94 39.7,82.4 47,82.4 | U$11.KATHODE 48.4,87.7 47,86.3 U$6.4 47,82.4
PP_IN
  Top 1.27: U$30.PAD1 U$30.P$1 24.4,97 U$38.1
RXD  (via drill 0.4)
  Top 0.152: U1.34 v52.51,13.89 v52.5,13.9 | U$35.1 46.83,4.47 44.8,6.5 44.8,13.4 45.23,13.83 v46.7,13.83
  Bottom 0.152: v52.5,13.9 52.43,13.83 v46.7,13.83
SCL  (via drill 0.35, 0.4)
  Top 0.152: R5.2 74.6,42.75 74.6,42 74.74,41.86 v74.74,41.64 | U$42.6 94.36,41.16 90.2,37 90.2,27.53 91,26.73 91,21.41 90.86,21.27 89.67,21.27 89.54,21.41 89.54,23.93 J3.3 86.7,25.75 84.46,23.5 84.46,23.43 v82.8,21.77 | v86.09,34.99 86.09,27.39 86.64,26.84 | U1.9 73.99,18.97 v74.06,18.9
  Top 0.2: 86.64,26.84 J3.3
  Bottom 0.152: v74.74,41.64 74.86,41.53 J1.3 79.55,41.53 v86.09,34.99 | v74.06,18.9 79.93,18.9 v82.8,21.77
SDA  (via drill 0.35, 0.4)
  Top 0.152: v75.2,40.05 72.8,42.45 R6.2 | U$42.5 93.09,41.2 88.8,36.9 v88.8,34.2 88.8,26.47 90.27,25 J3.4 | U1.6 74.14,15.16 v74.2,15.1 | v79.5,34.5 79.5,32.95 79.73,32.72 79.73,15.73 v79.1,15.1
  Bottom 0.152: v88.8,34.2 82.14,34.2 79.87,36.47 | 79.87,36.47 79.83,36.52 79.83,38.81 J1.4 76.21,38.99 75.2,40 v75.2,40.05 | v74.2,15.1 v79.1,15.1 | 79.87,36.47 79.5,36.1 v79.5,34.5
SYSTEM_LOAD  (via drill 0.35)
  Top 0.305: R59.2 93.9,15.55 v93.9,13.2
  Top 1.016: J3.6 96.45,21.36 v96.45,15.75
  Bottom 1.016: v96.45,15.75 v93.9,13.2
  pour Top (rank 2, no thermals): 92.2,13.8 97.9,13.8 97.9,8.4 93.4,8.4 93.4,10.1 92.2,11.3
TXD  (via drill 0.4)
  Top 0.152: U1.35 52.29,12.62 v52.24,12.57 | v49.2,12.5 46.86,12.5 U$35.5
  Bottom 0.152: v52.24,12.57 49.27,12.57 v49.2,12.5
USB_5V
  Top 0.152: U$18.B4/A9 81.05,4.5 79.83,3.29 77.75,3.29 77.74,3.3 76.7,3.3 76.58,3.42 76.58,5.27 76.35,5.5 U$18.A4/B9 76.35,6.65 77.09,7.39 79,7.39 80.96,9.35 R70.1 81.6,9.35 R58.1
USB_CC
  Top 0.152: U$18.A5 76.95,6.64 77.3,7 79.13,7 79.84,7.7 81.5,7.7 82.2,8.4 R58.2
USB_D+  (via drill 0.35)
  Top 0.152: v79.1,4.2 78.95,4.35 78.95,3.95 78.45,4.45 U$18.A6
USB_D-  (via drill 0.35)
  Top 0.152: v78,3.9 78.14,3.9 78.45,3.59 79.71,3.59 79.71,4.45 79.45,4.71 U$18.A7
VBAT  (via drill 0.35)
  Top 0.2: 93.58,49.58 93.38,49.78
  Top 0.508: v98.8,34.6 99.1,34.9 99.1,43.3 96,46.4 94.36,46.4 U$42.3 94.36,48.8 93.58,49.58 | 93.38,49.78 92.6,50.56 v92.6,53.43
  Bottom 0.2: 90.65,55.19 U$41.P$2
  Bottom 0.508: v92.6,53.43 90.75,55.28 90.65,55.19 | U$41.P$1 96.57,32.37 v98.8,34.6

### Text on the board
tPlace: PP | CP | openevsetester v0.6 05/2021, a.l.